# EasyEDA schematic Schematic_Tektronix Auxiliary Front Panel (AFP)_ Rev B.json

## Sheets
1 5V Power Input: TITLE: Tektronix Auxiliary Front Panel (AFP); REV: B; Date: 2026-03-07; Sheet: 1/9; Drawn By: Nawaf Altalhi; Company: Portland State University
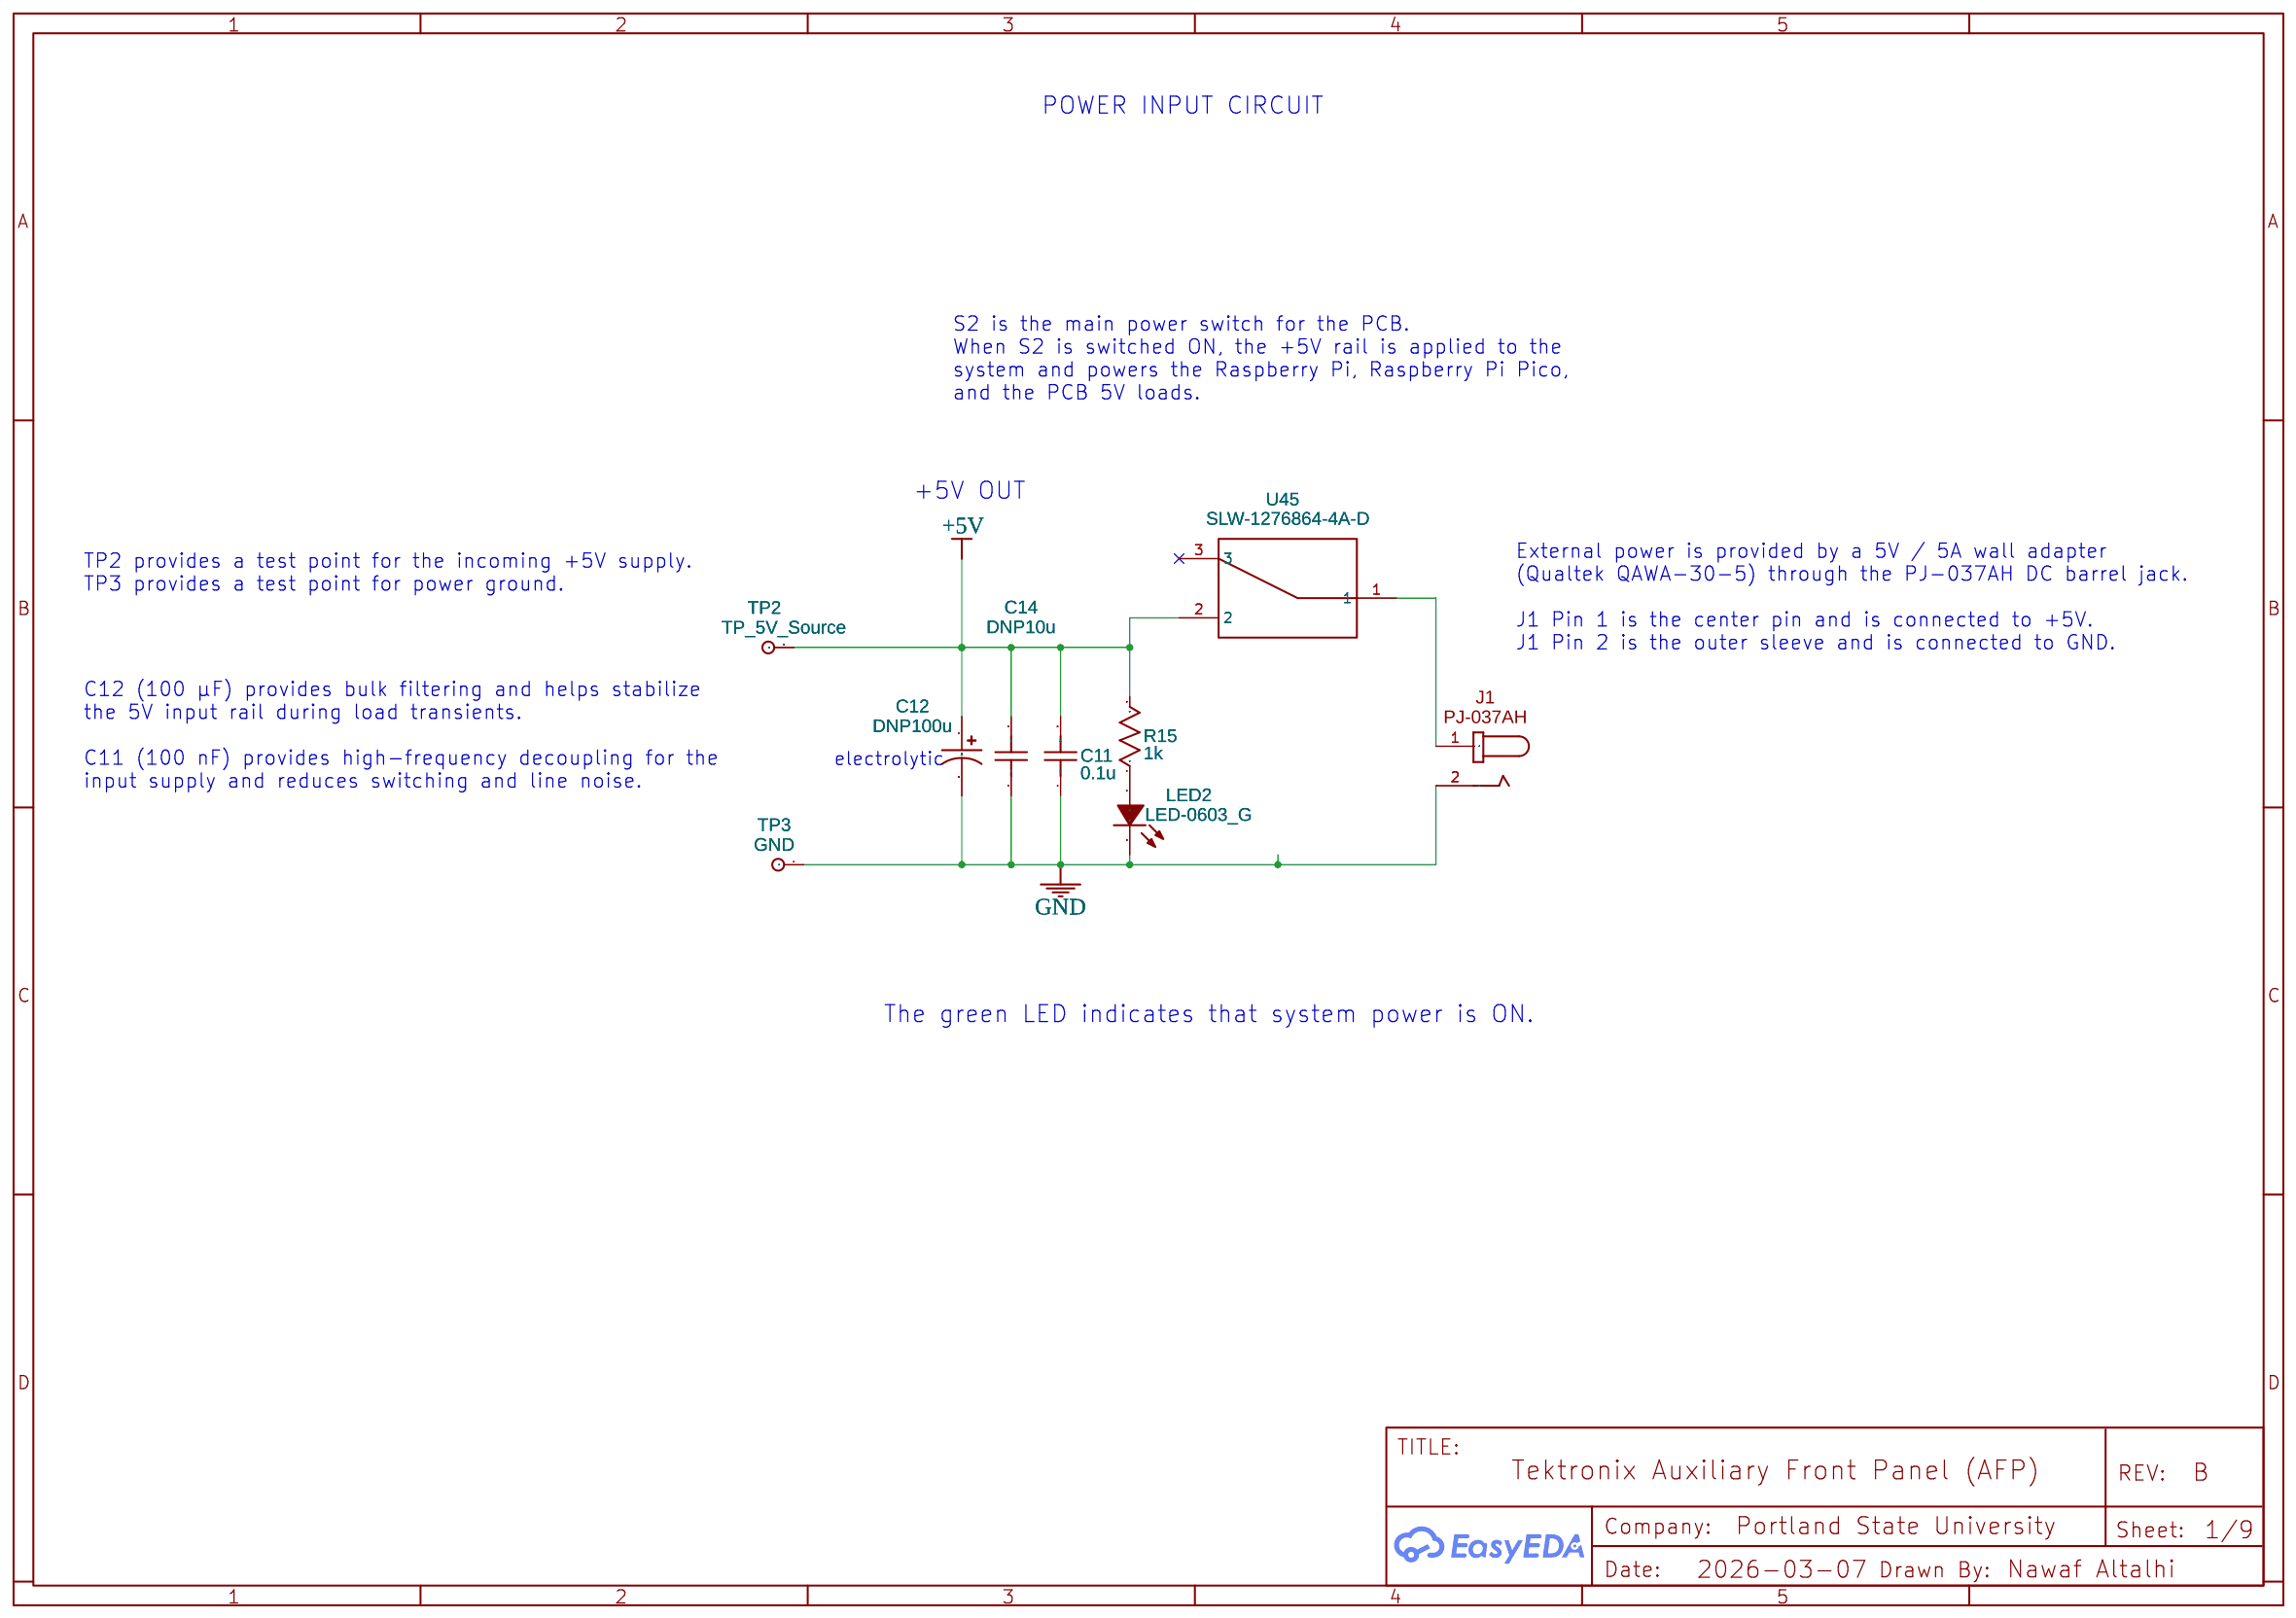
[diagram p0: 5V Power Input]
2 Raspberry Pi Pico Interface: Sheet: 2/9
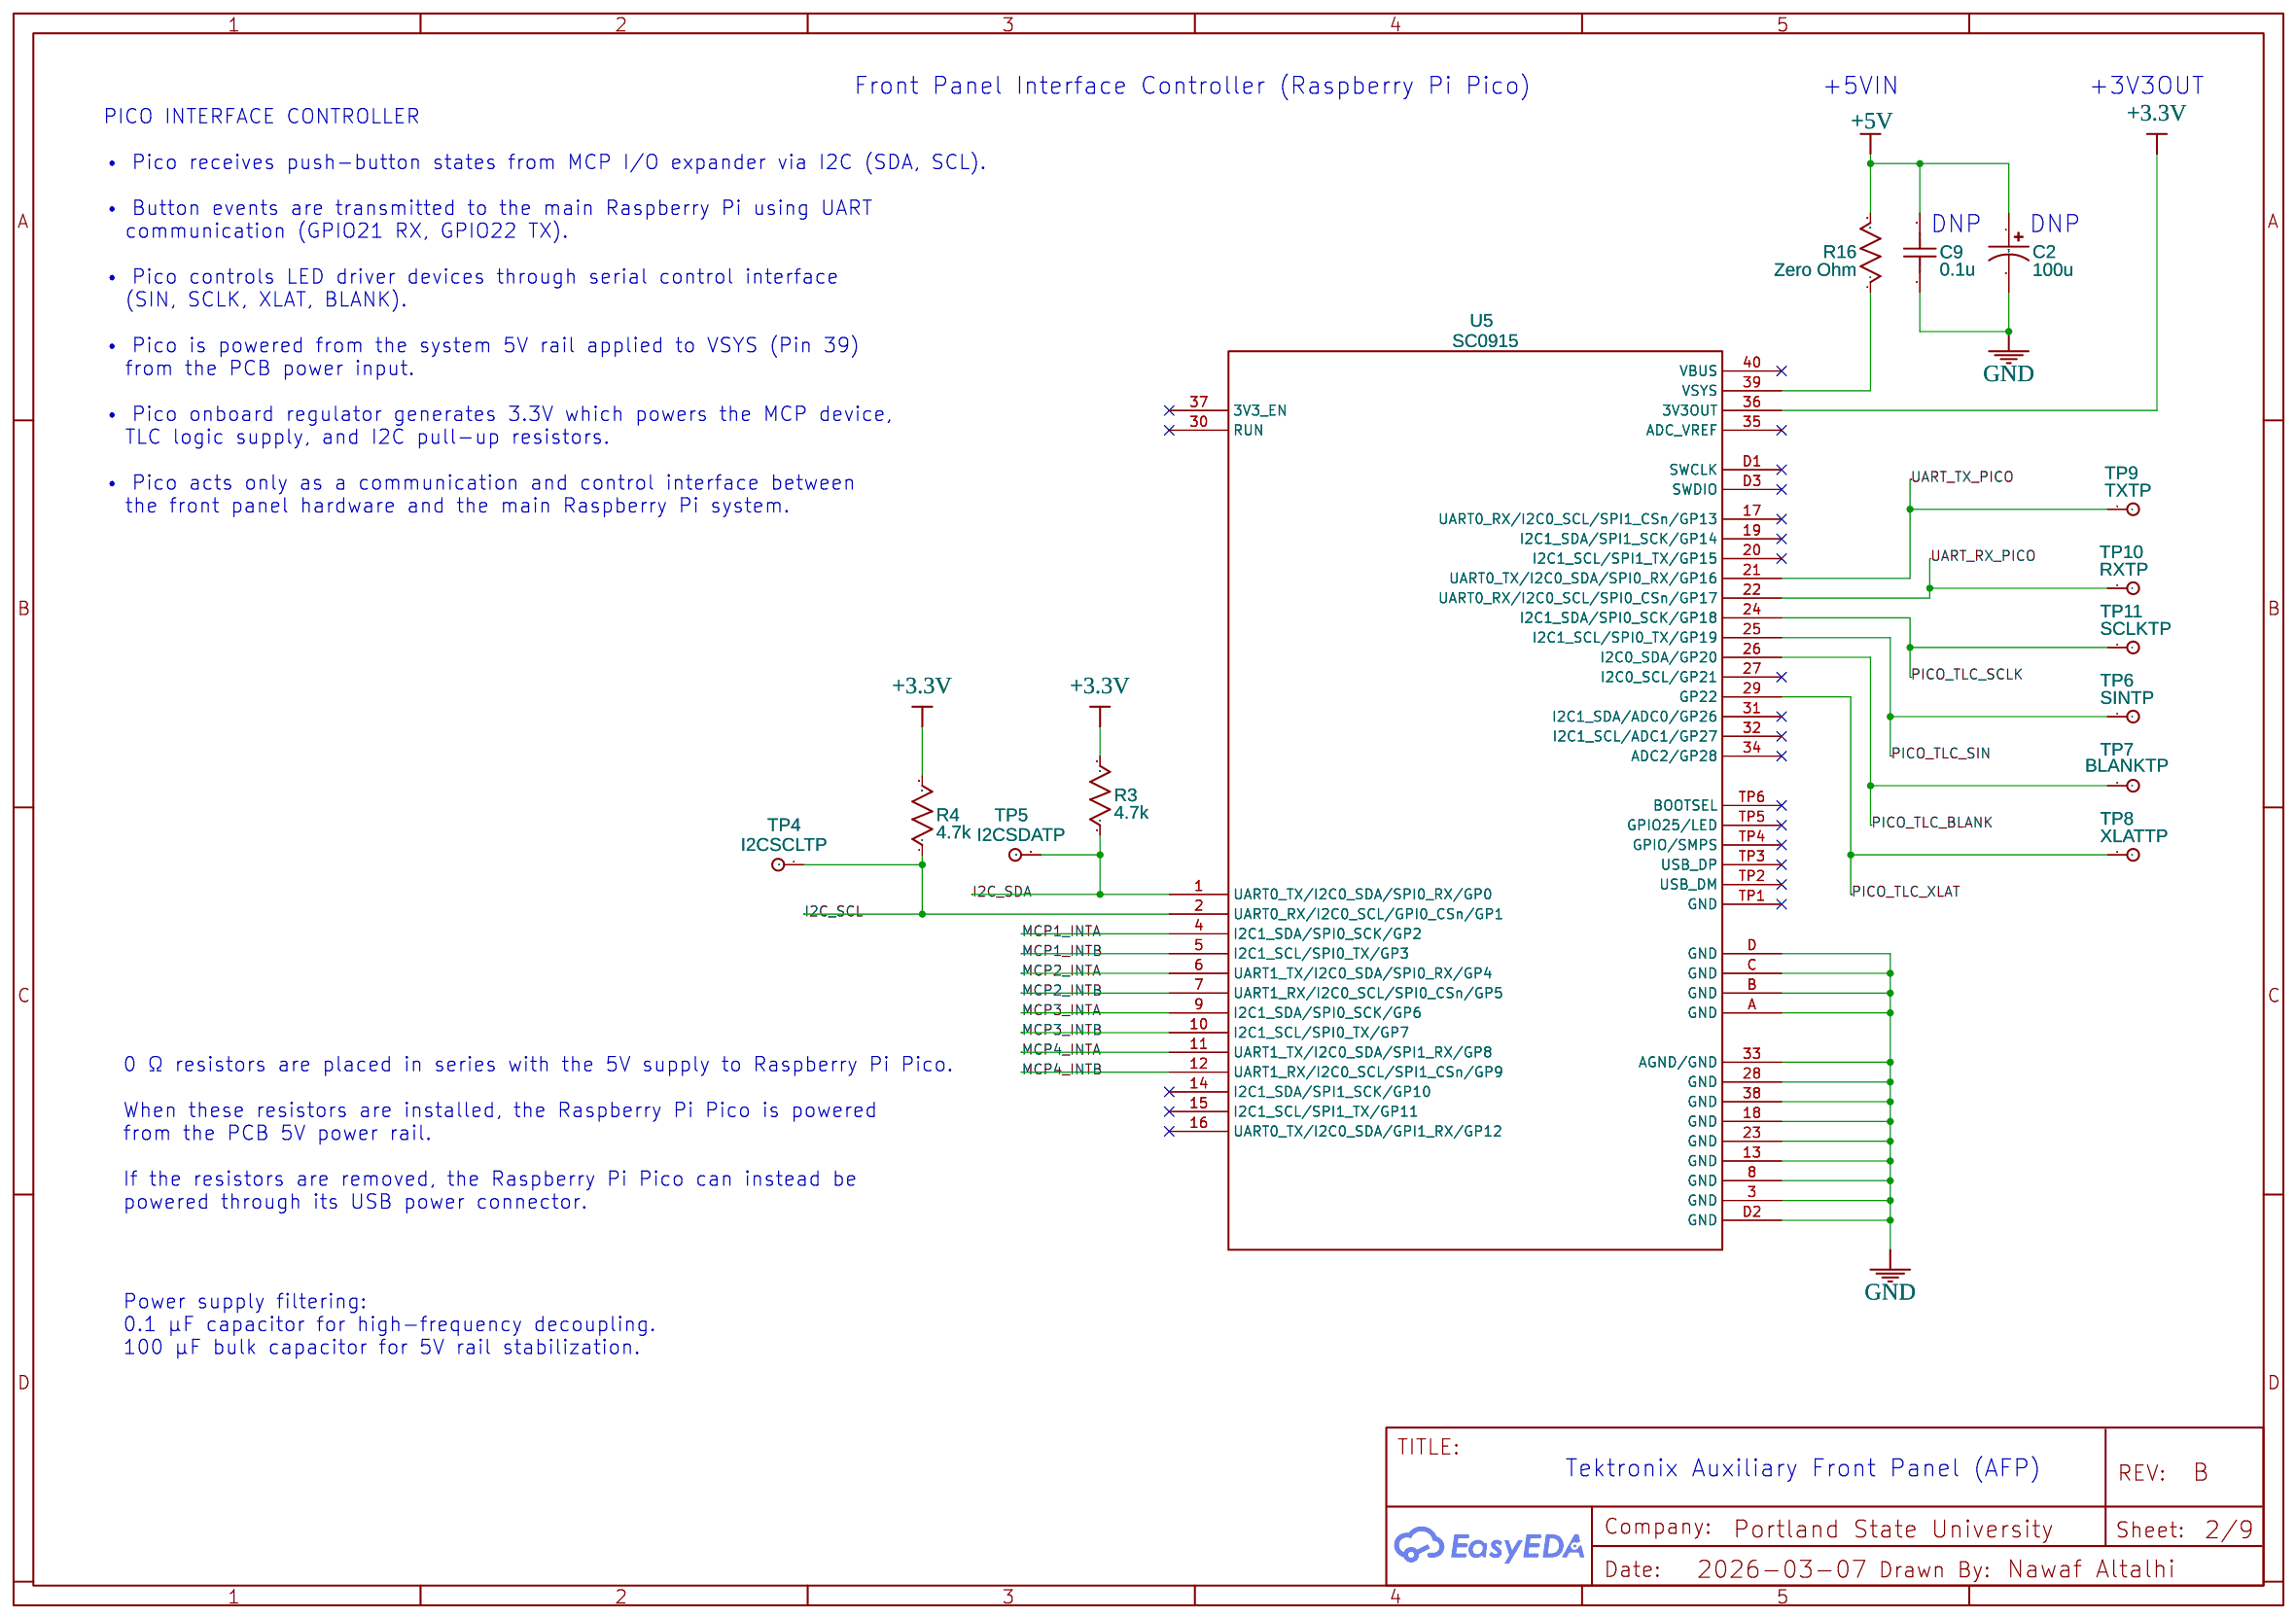
[diagram p1: Raspberry Pi Pico Interface]
3 Raspberry Pi Controller: Date: 2026-03-08; Sheet: 3/9
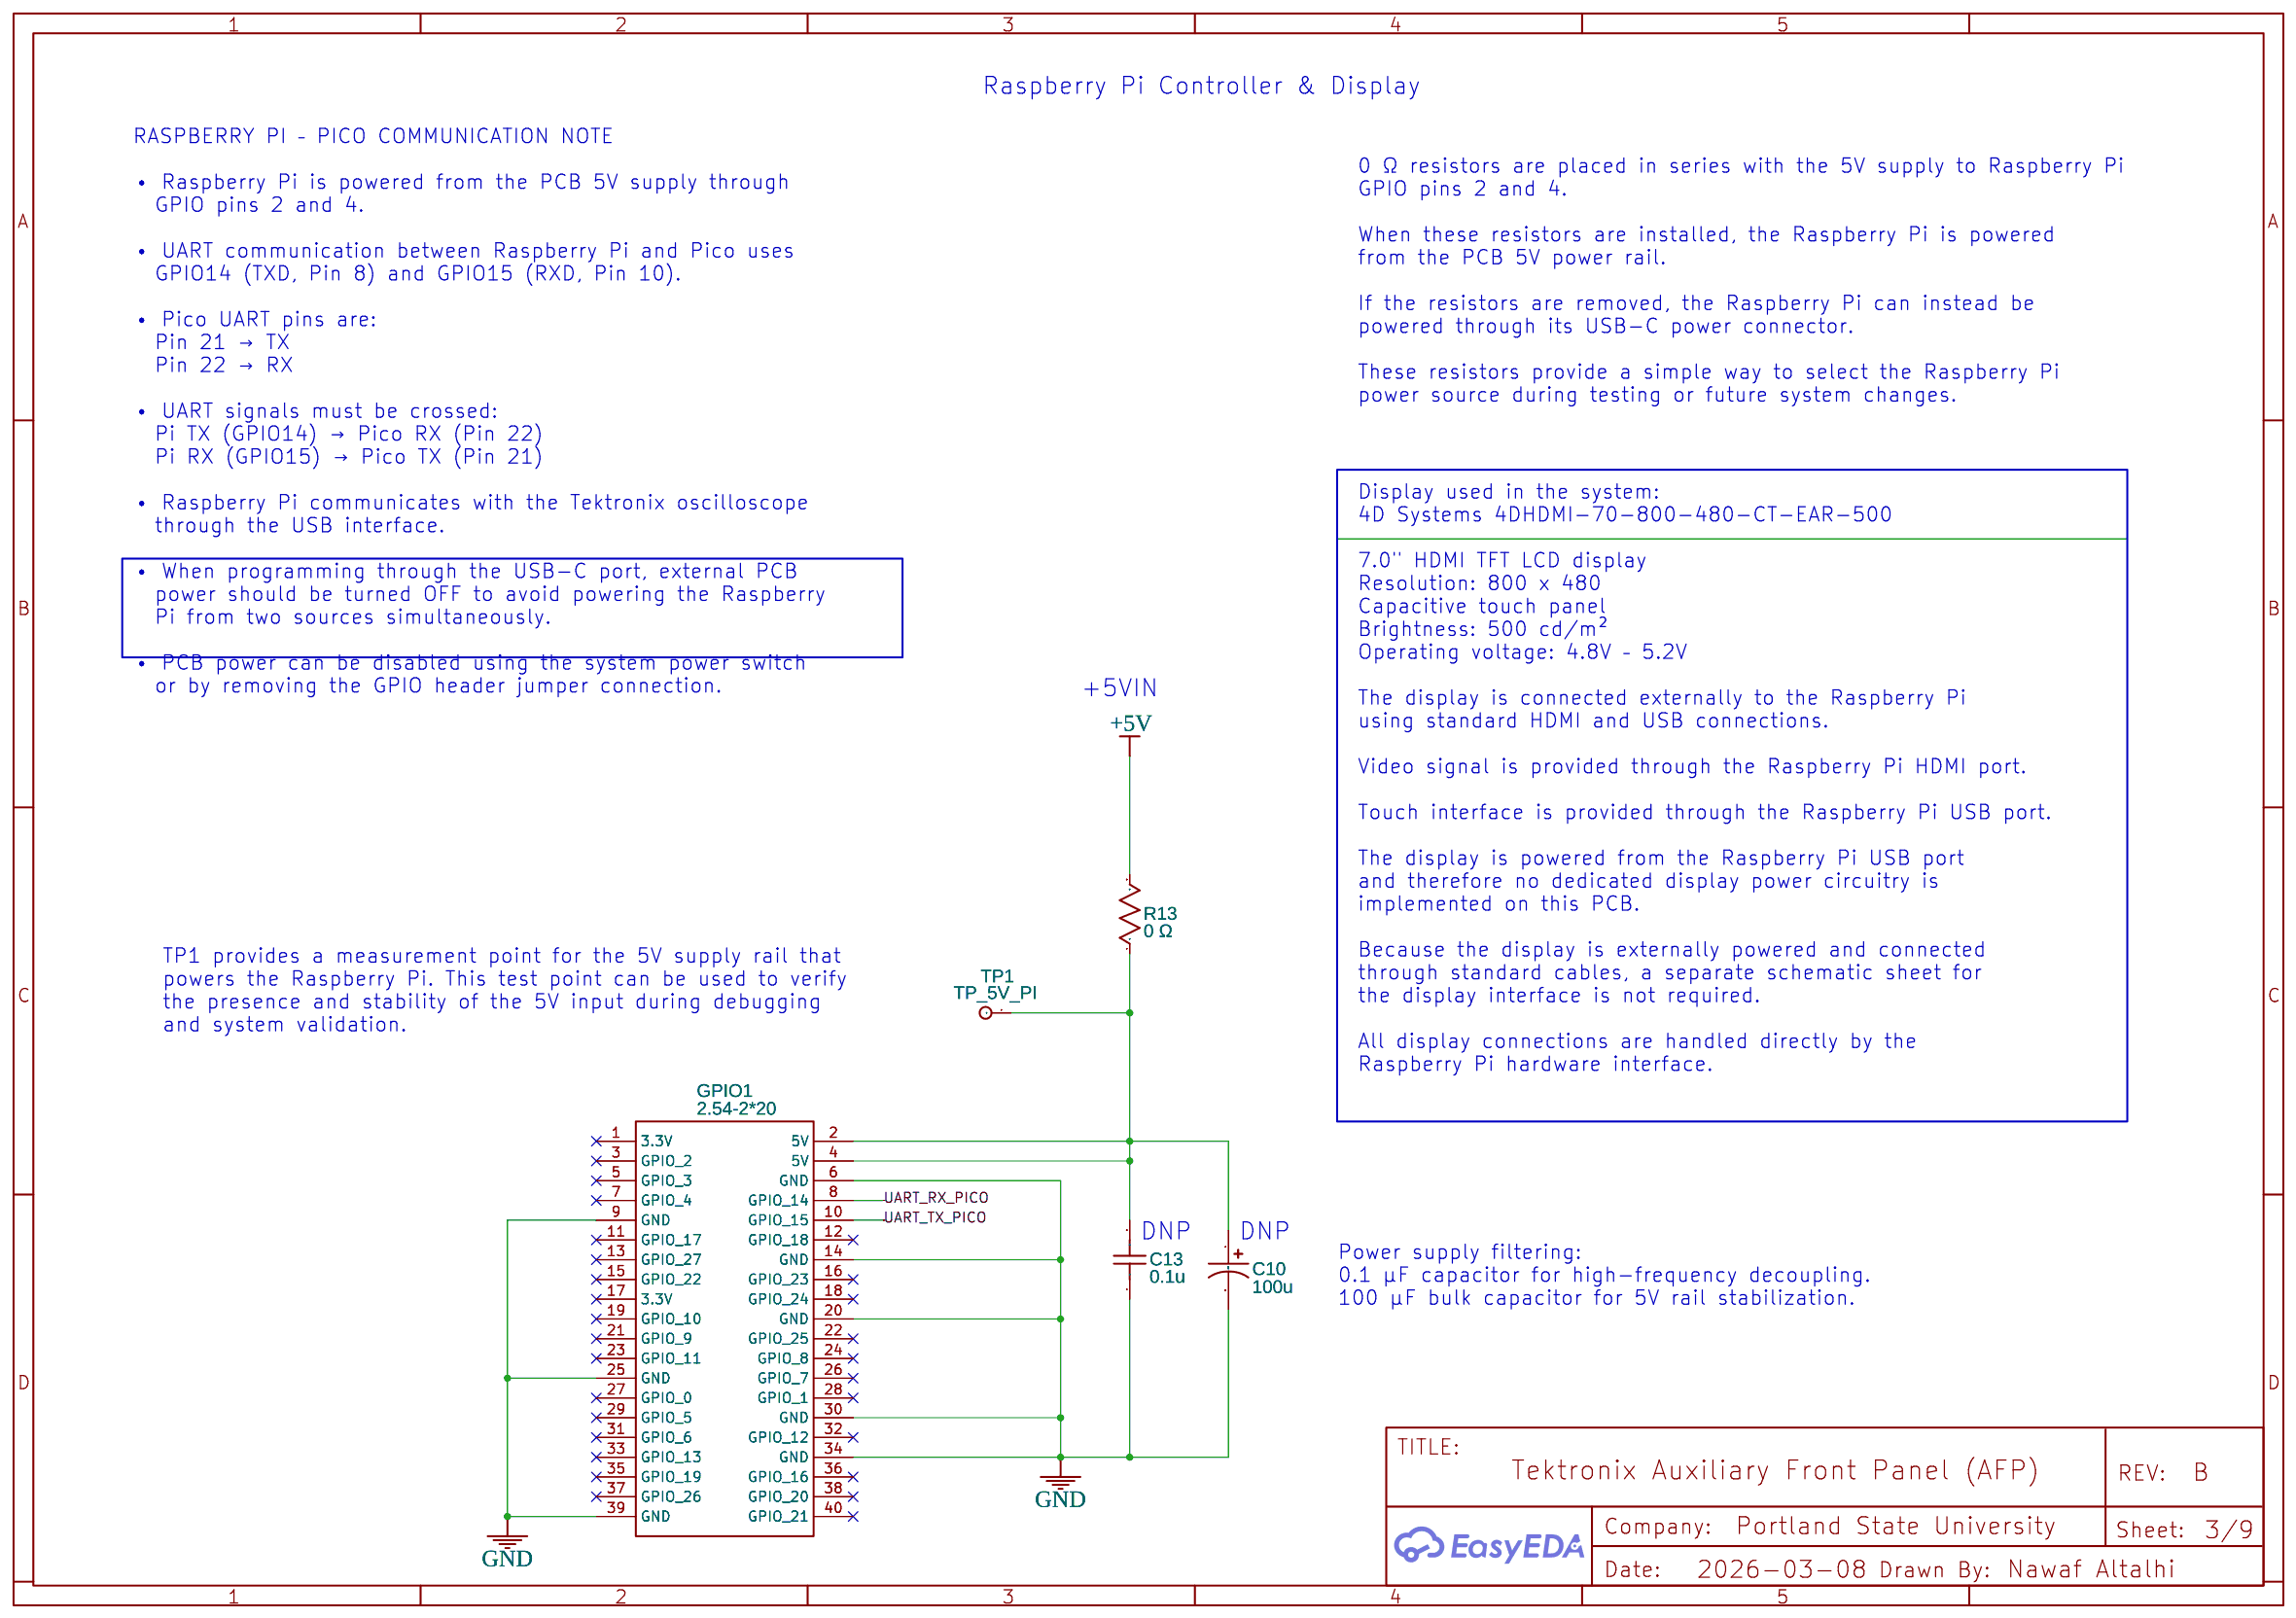
[diagram p2: Raspberry Pi Controller]
4 MCP23017: Date: 2026-03-09; Sheet: 4/9
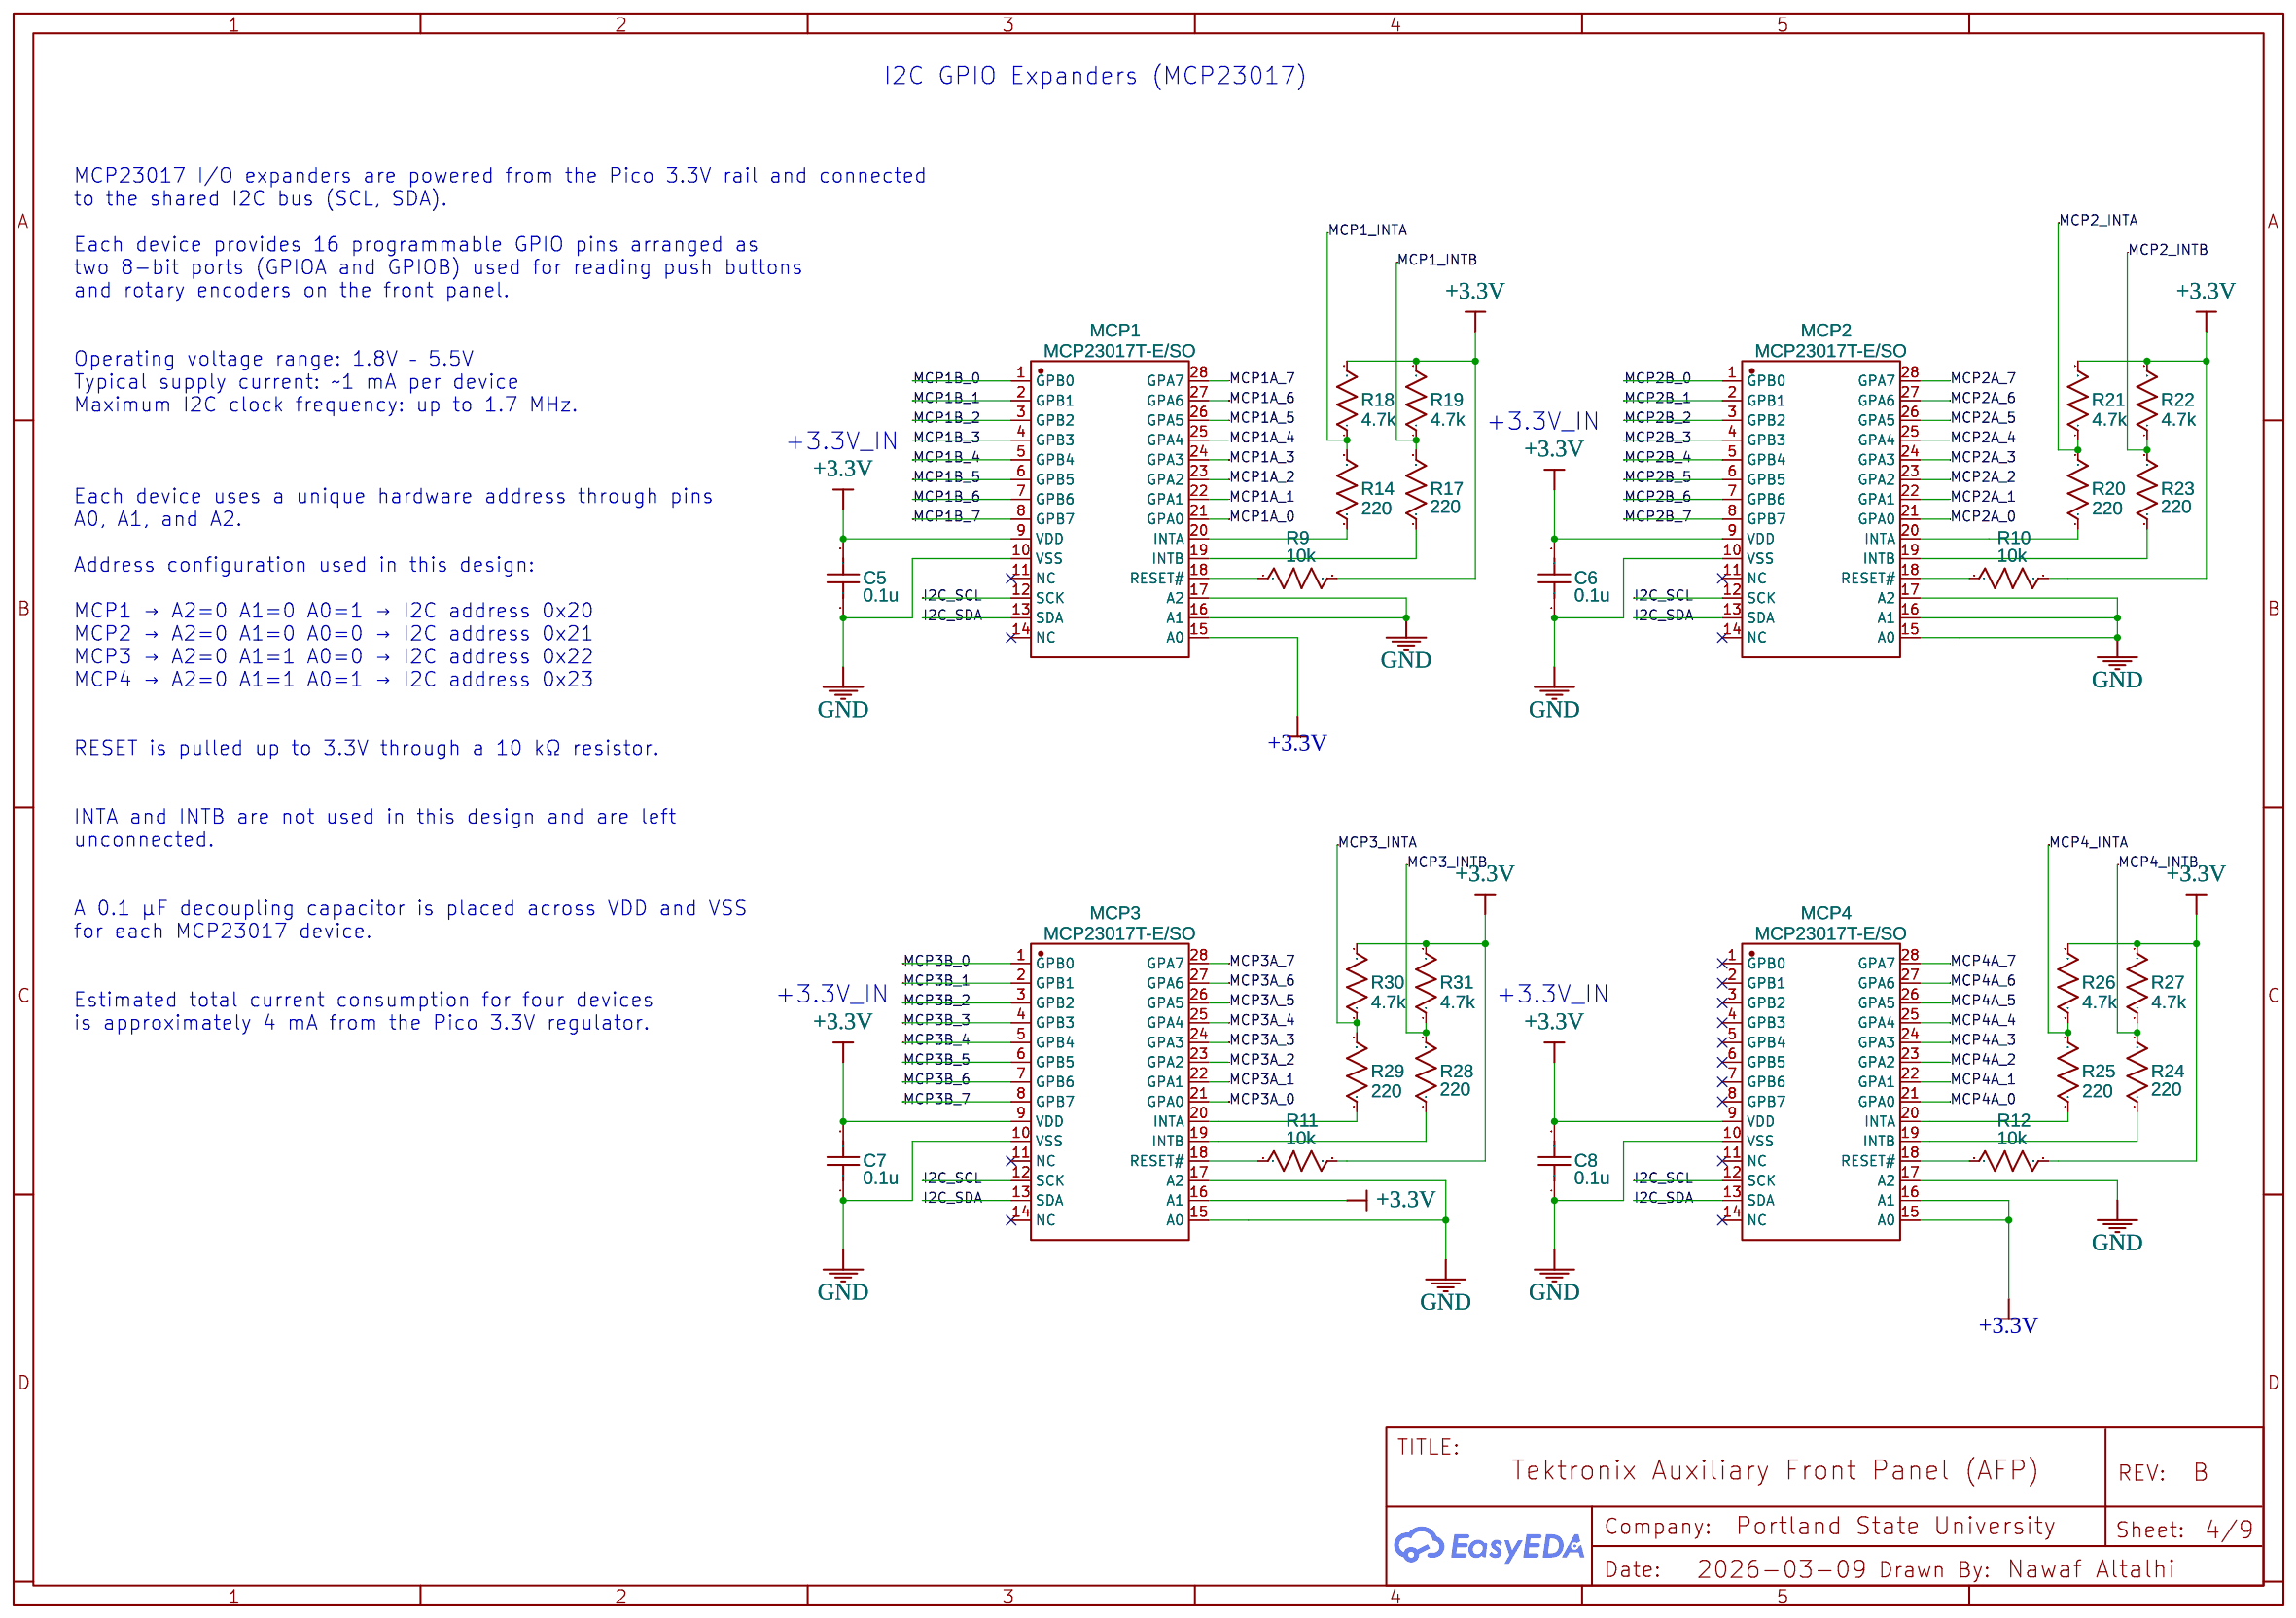
[diagram p3: MCP23017]
5 TLC5947: Date: 2026-03-08; Sheet: 5/9
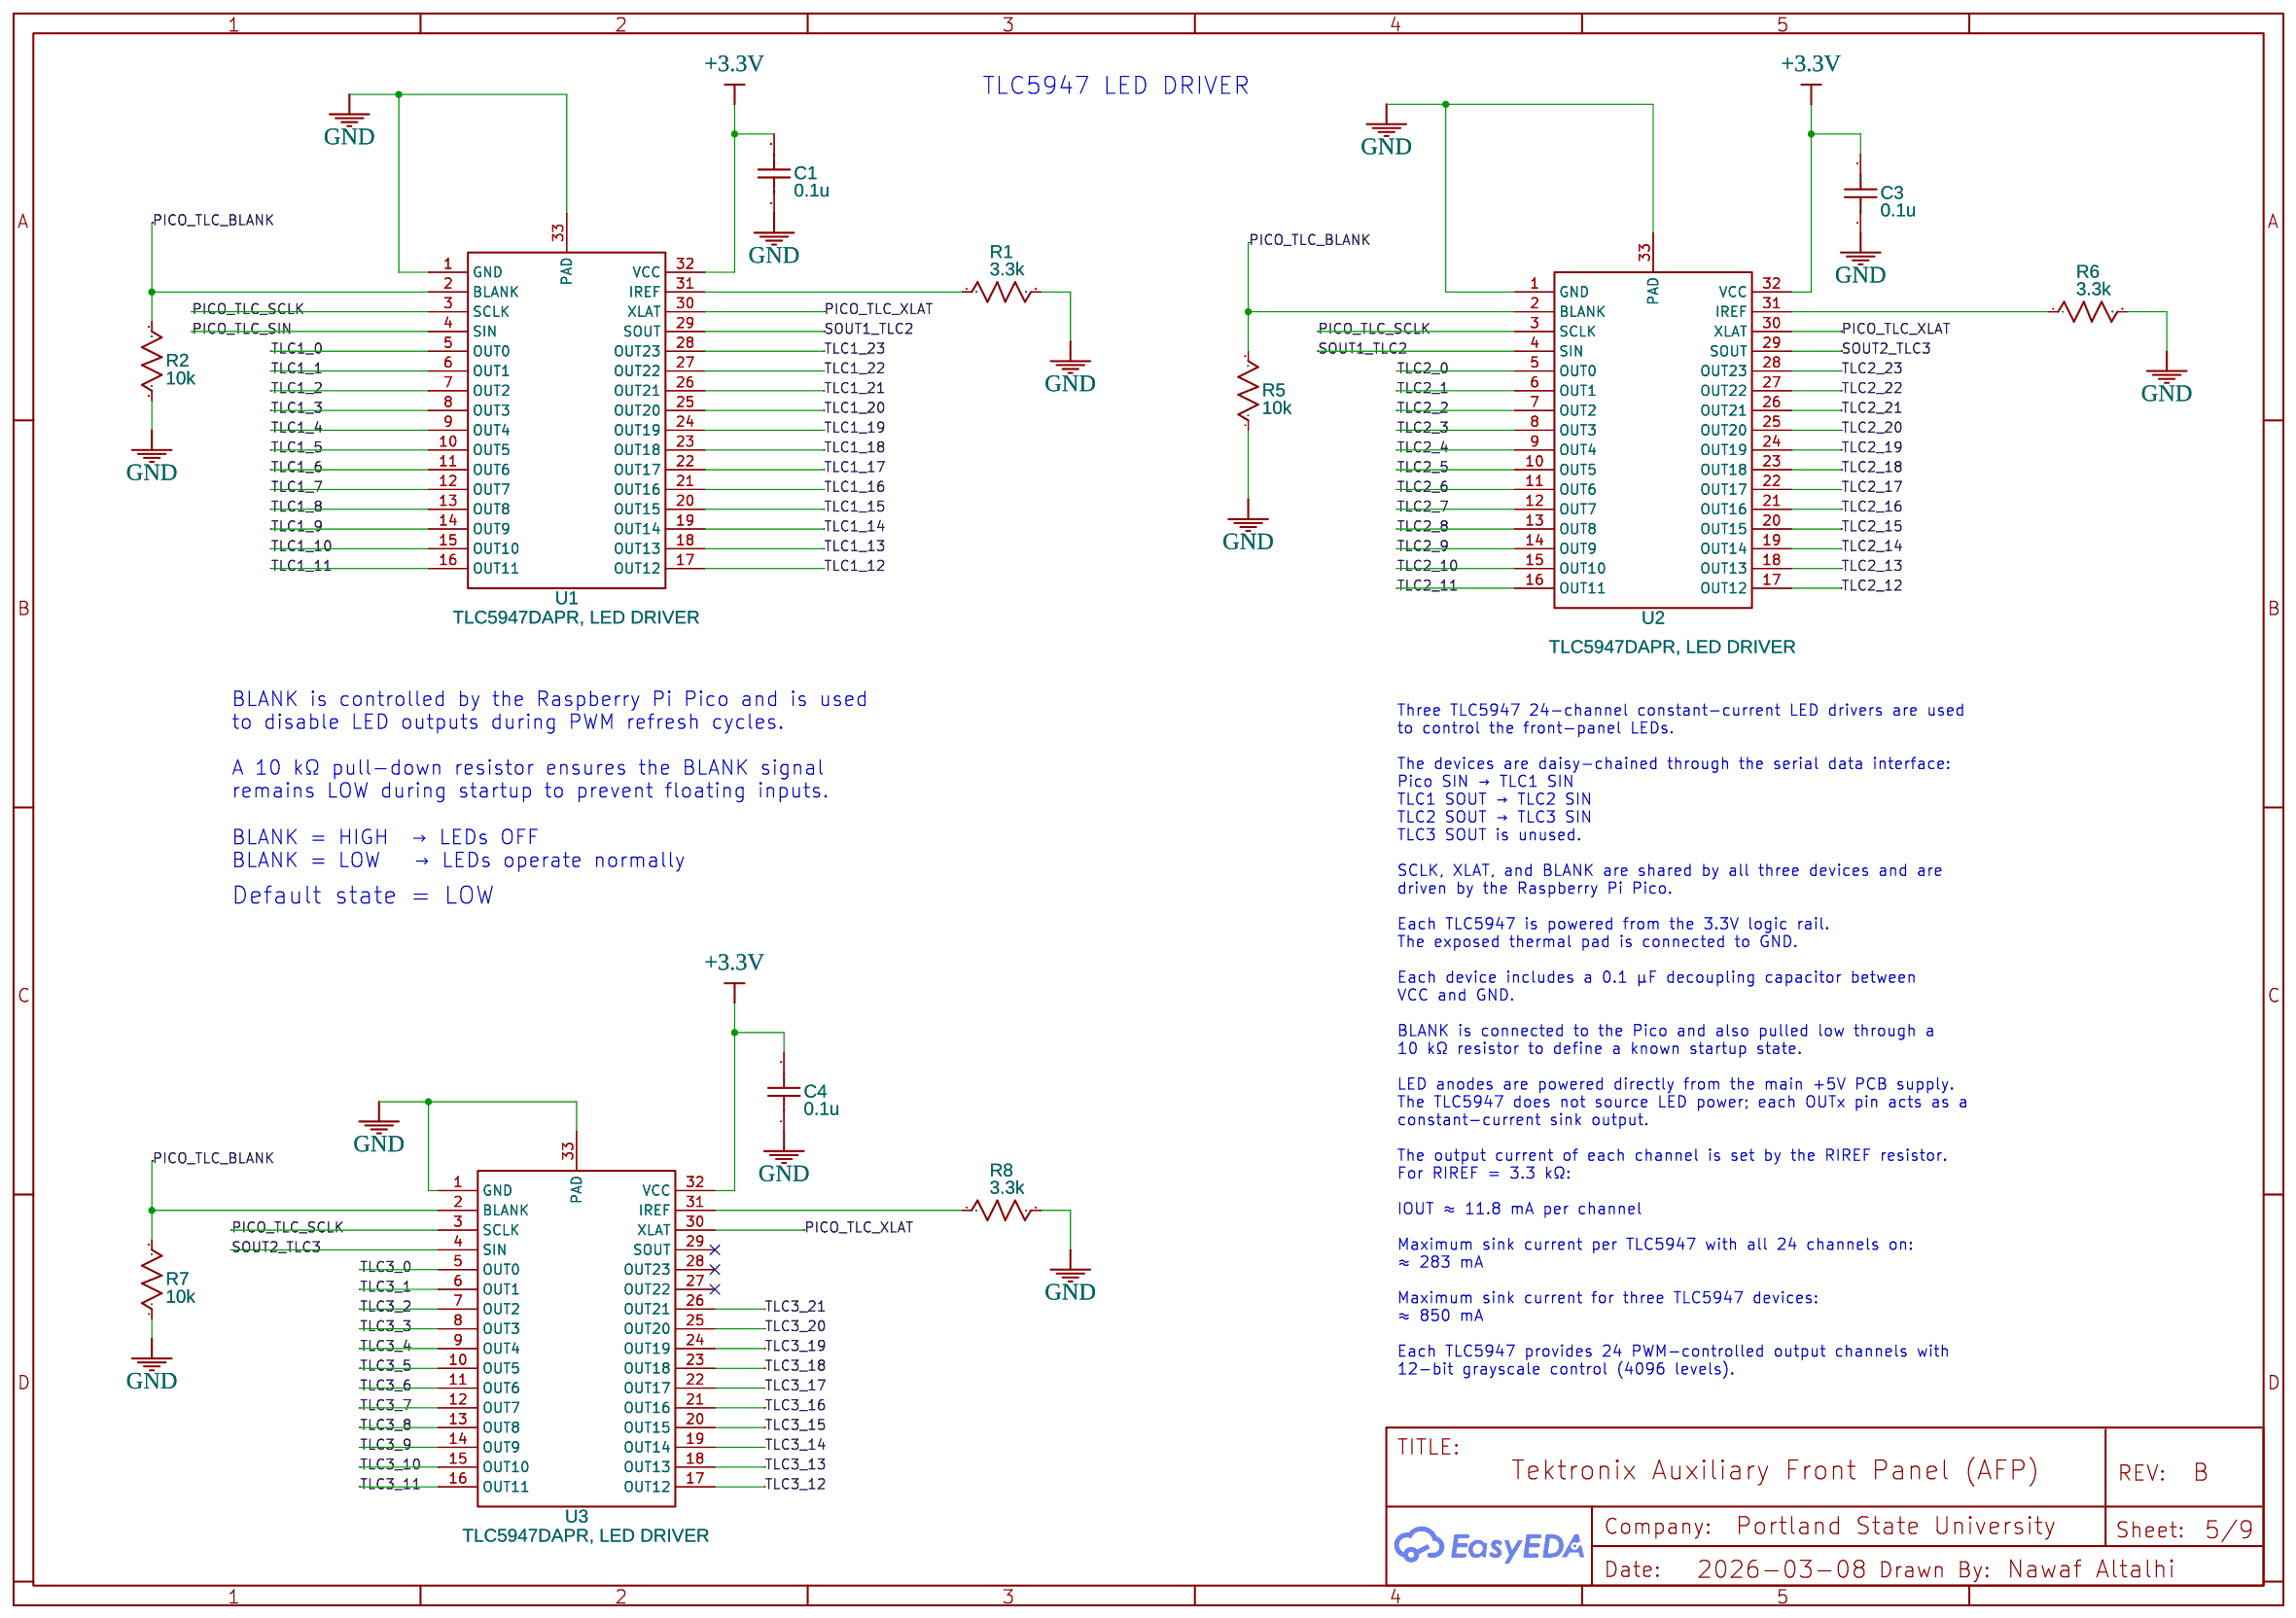
[diagram p4: TLC5947]
6 Acquisition & Trigger Controls: Date: 2026-03-09; Sheet: 6/9
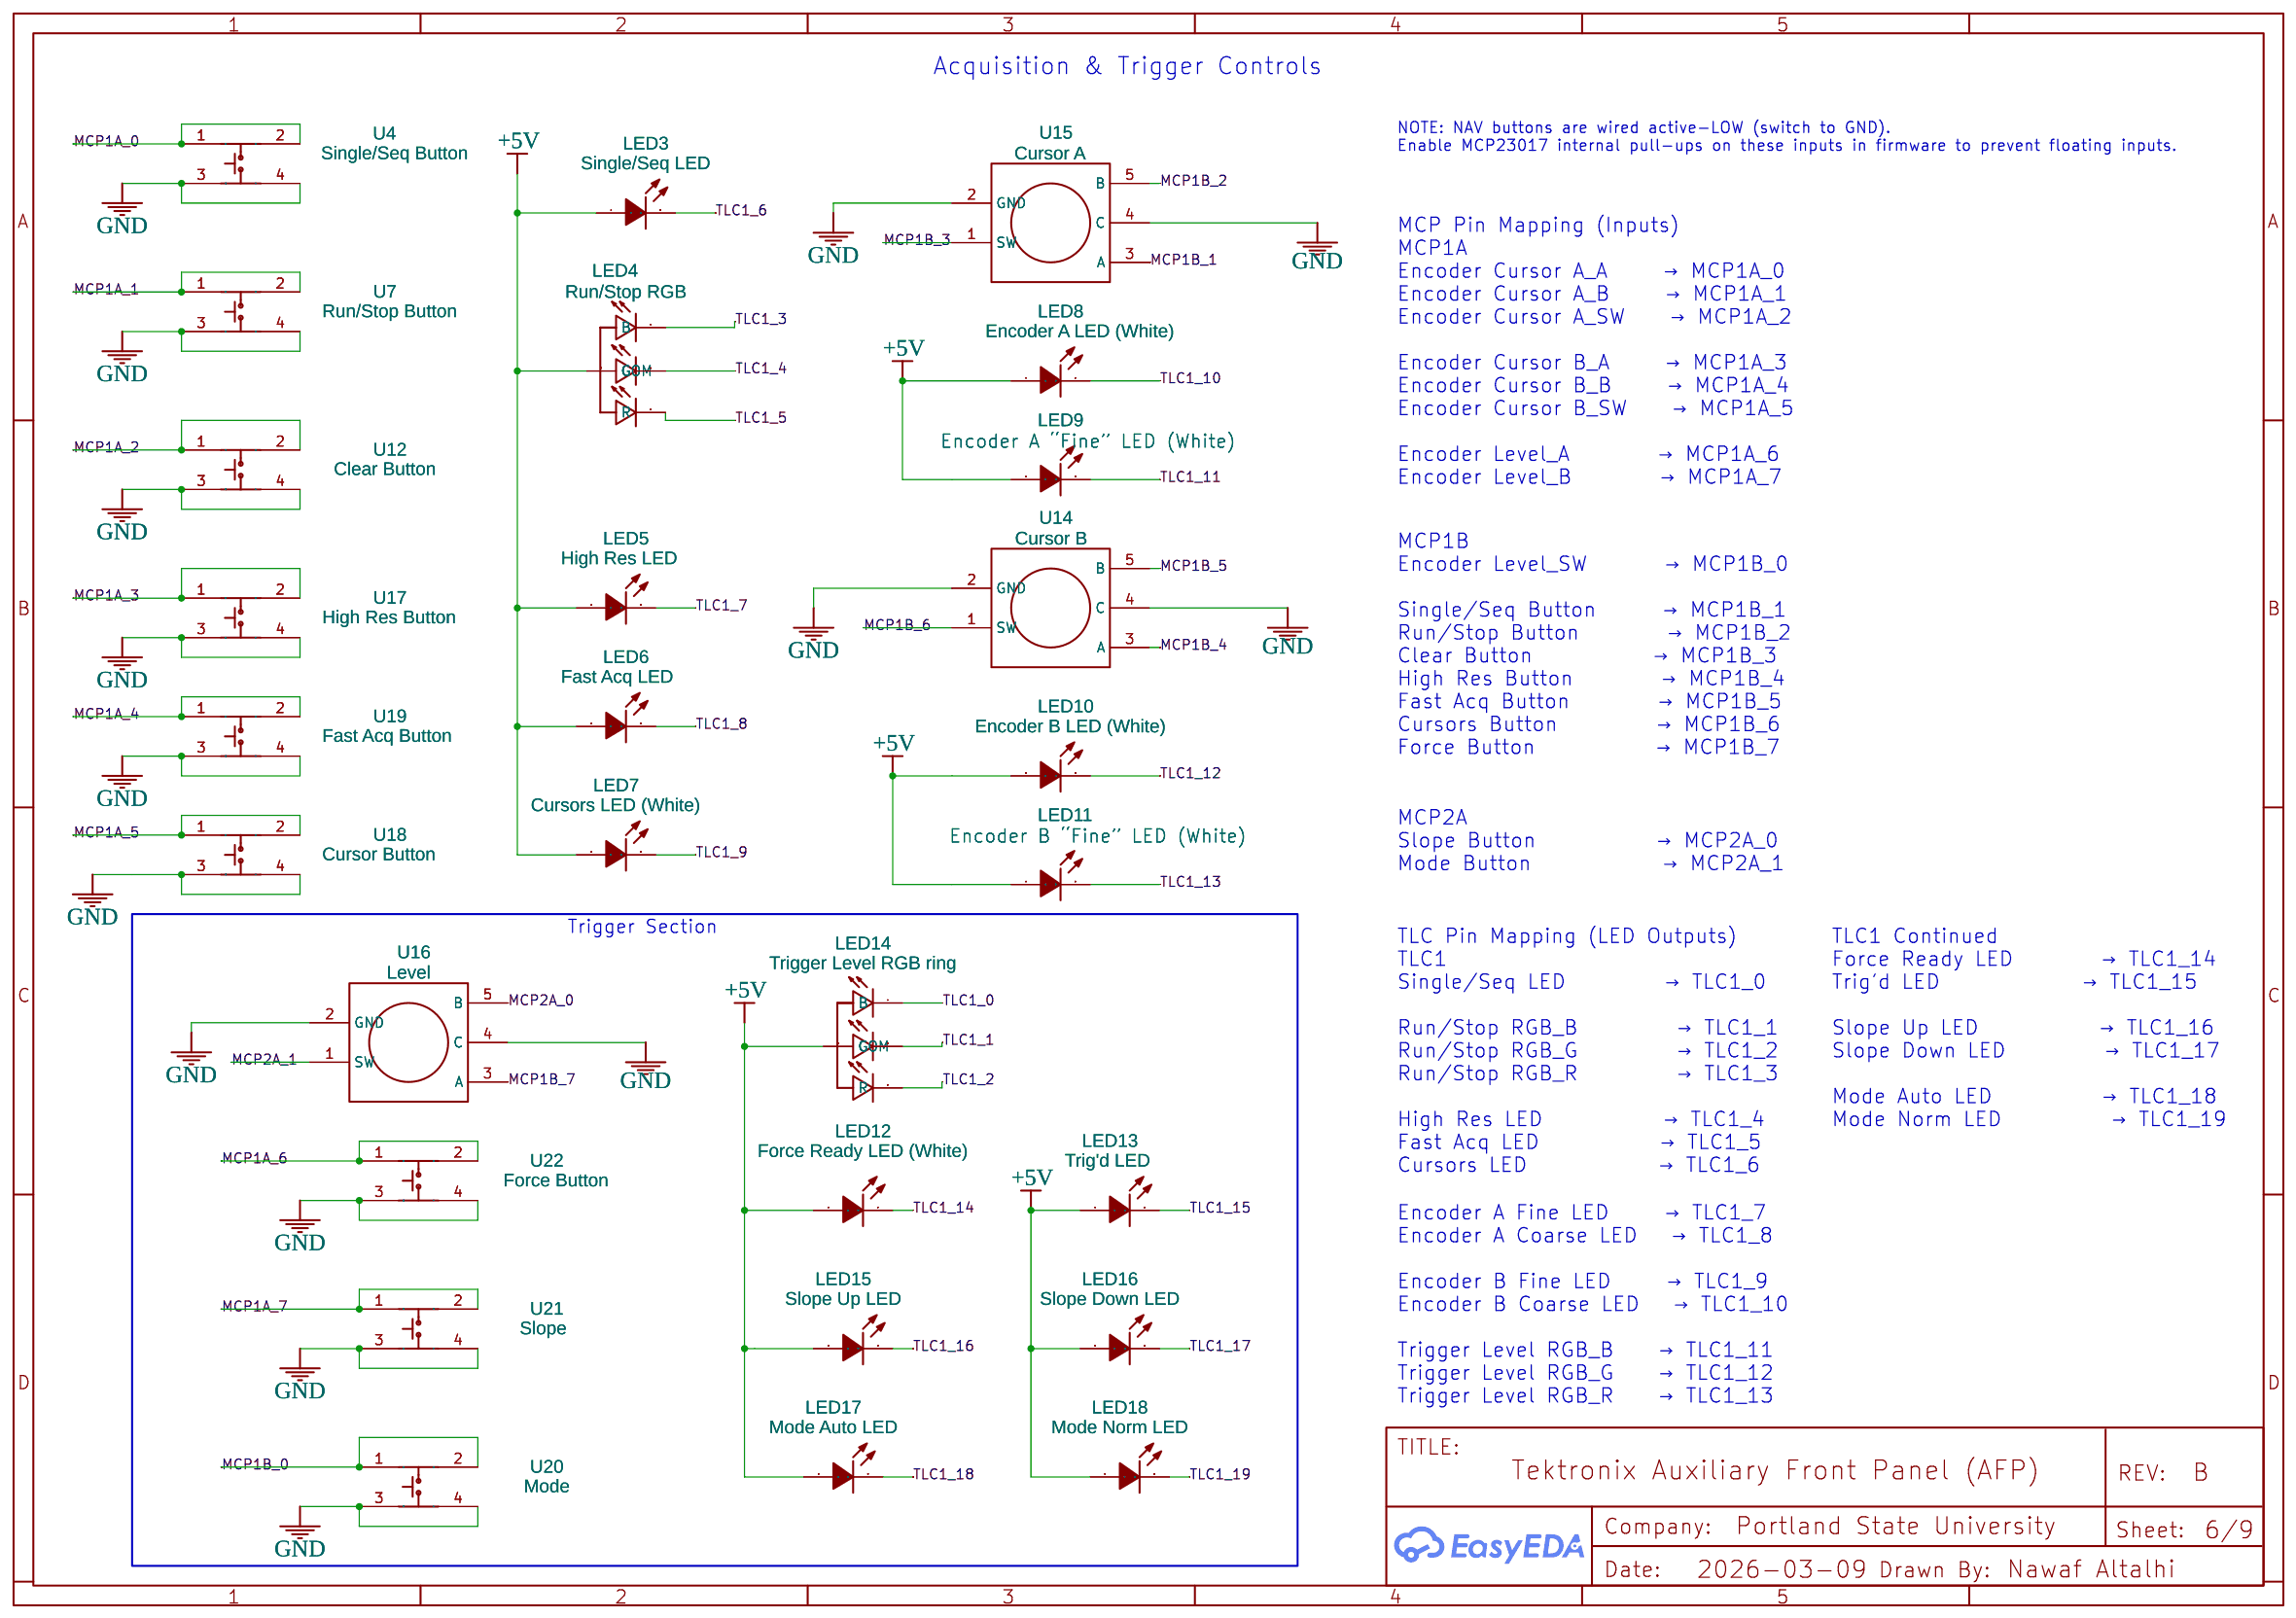
[diagram p5: Acquisition & Trigger Controls]
7 VERTICAL: Date: 2026-03-09; Sheet: 7/9
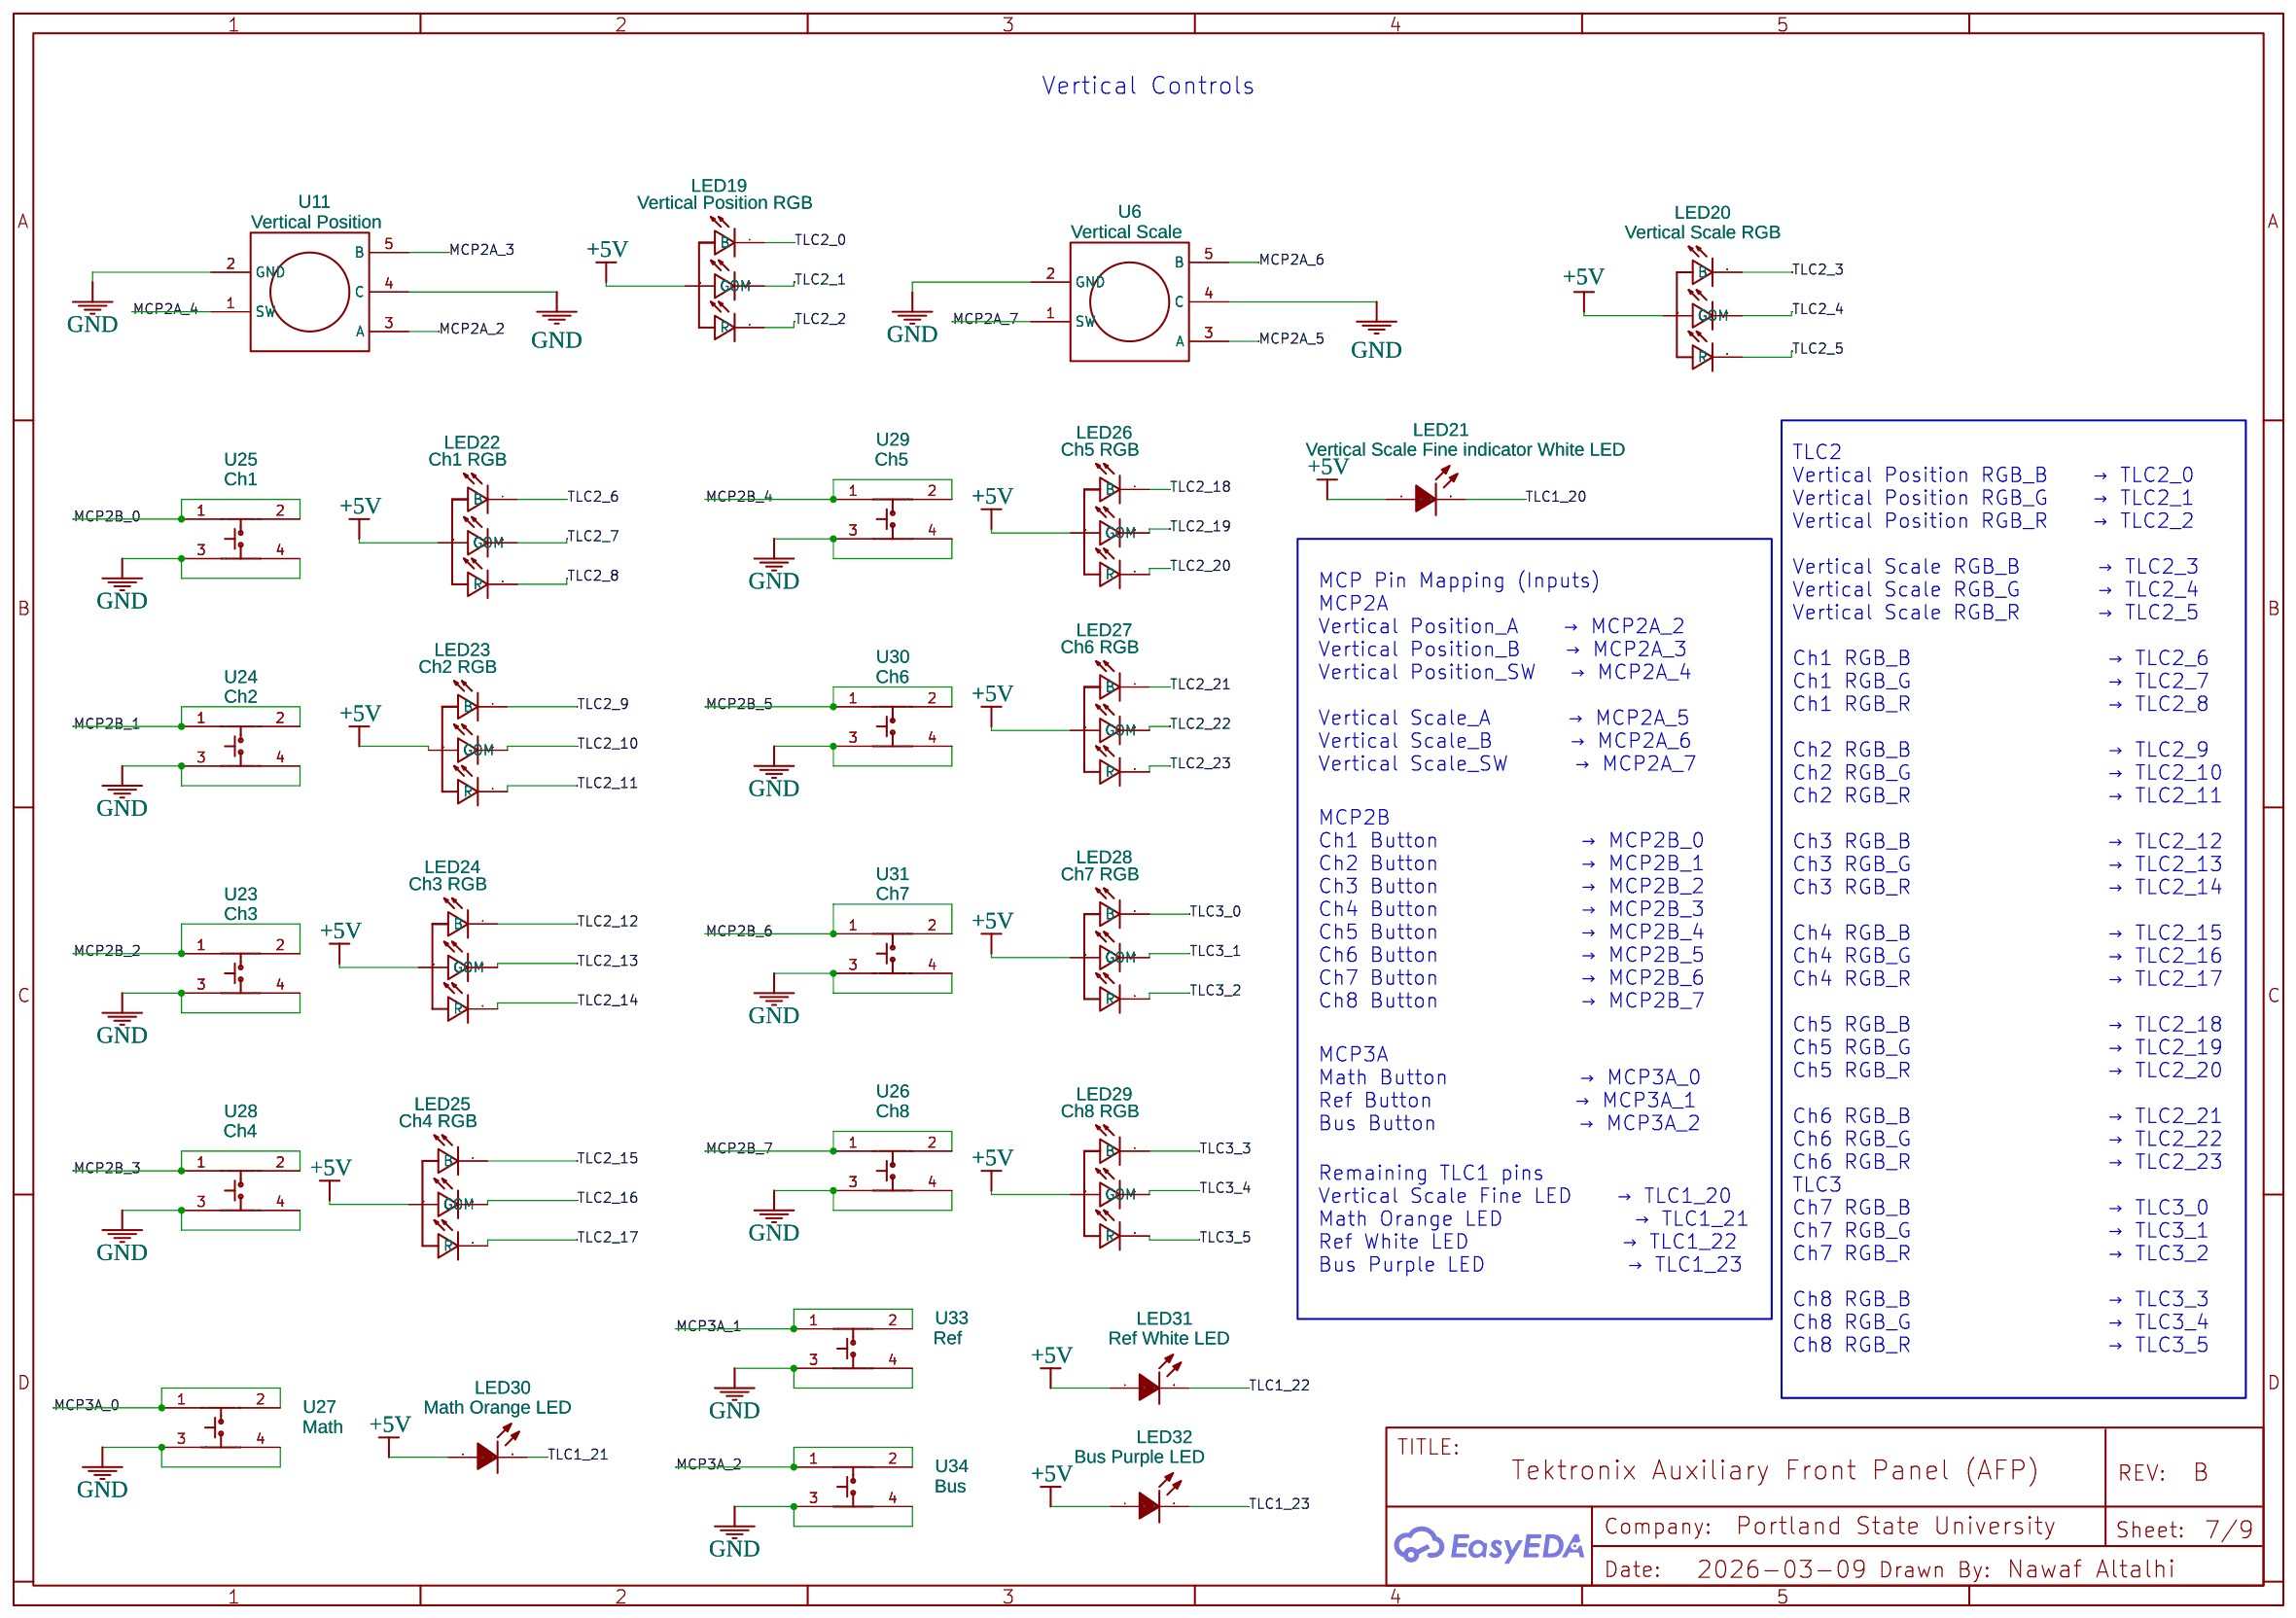
[diagram p6: VERTICAL]
8 HORIZONTAL: Date: 2026-03-09; Sheet: 8/9
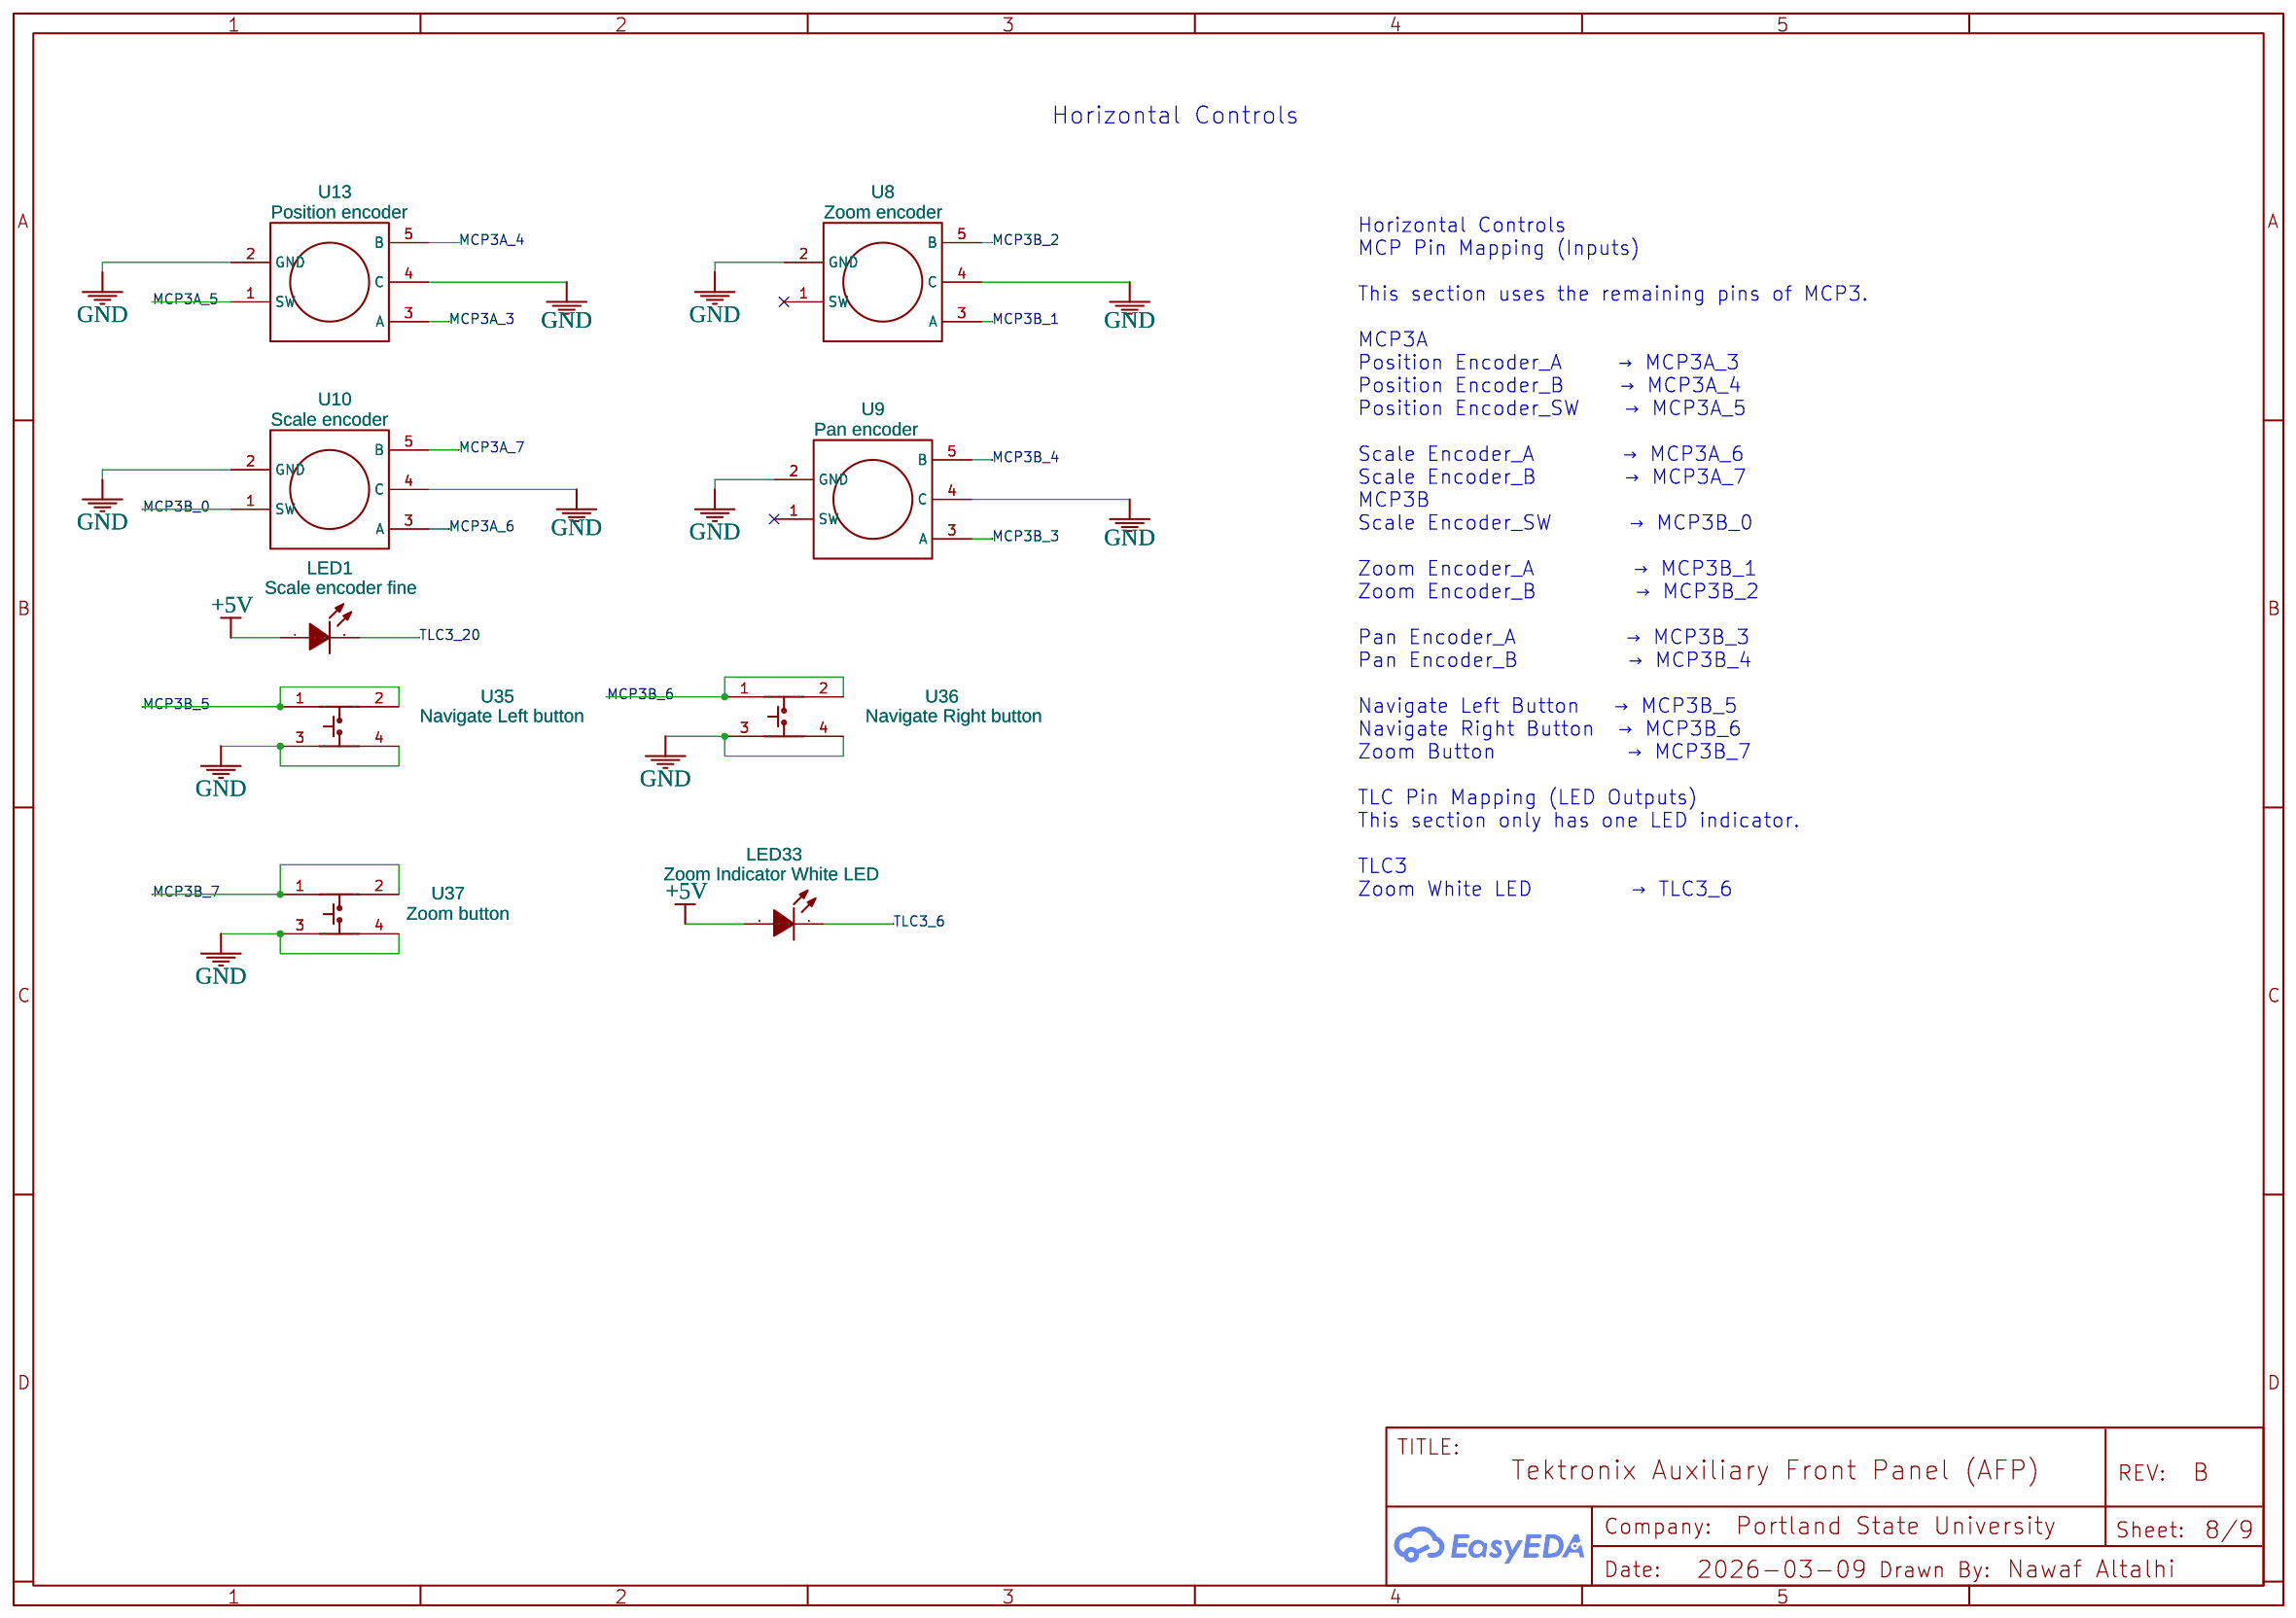
[diagram p7: HORIZONTAL]
9 Miscellaneous controls& Macro: Date: 2026-03-09; Sheet: 9/9
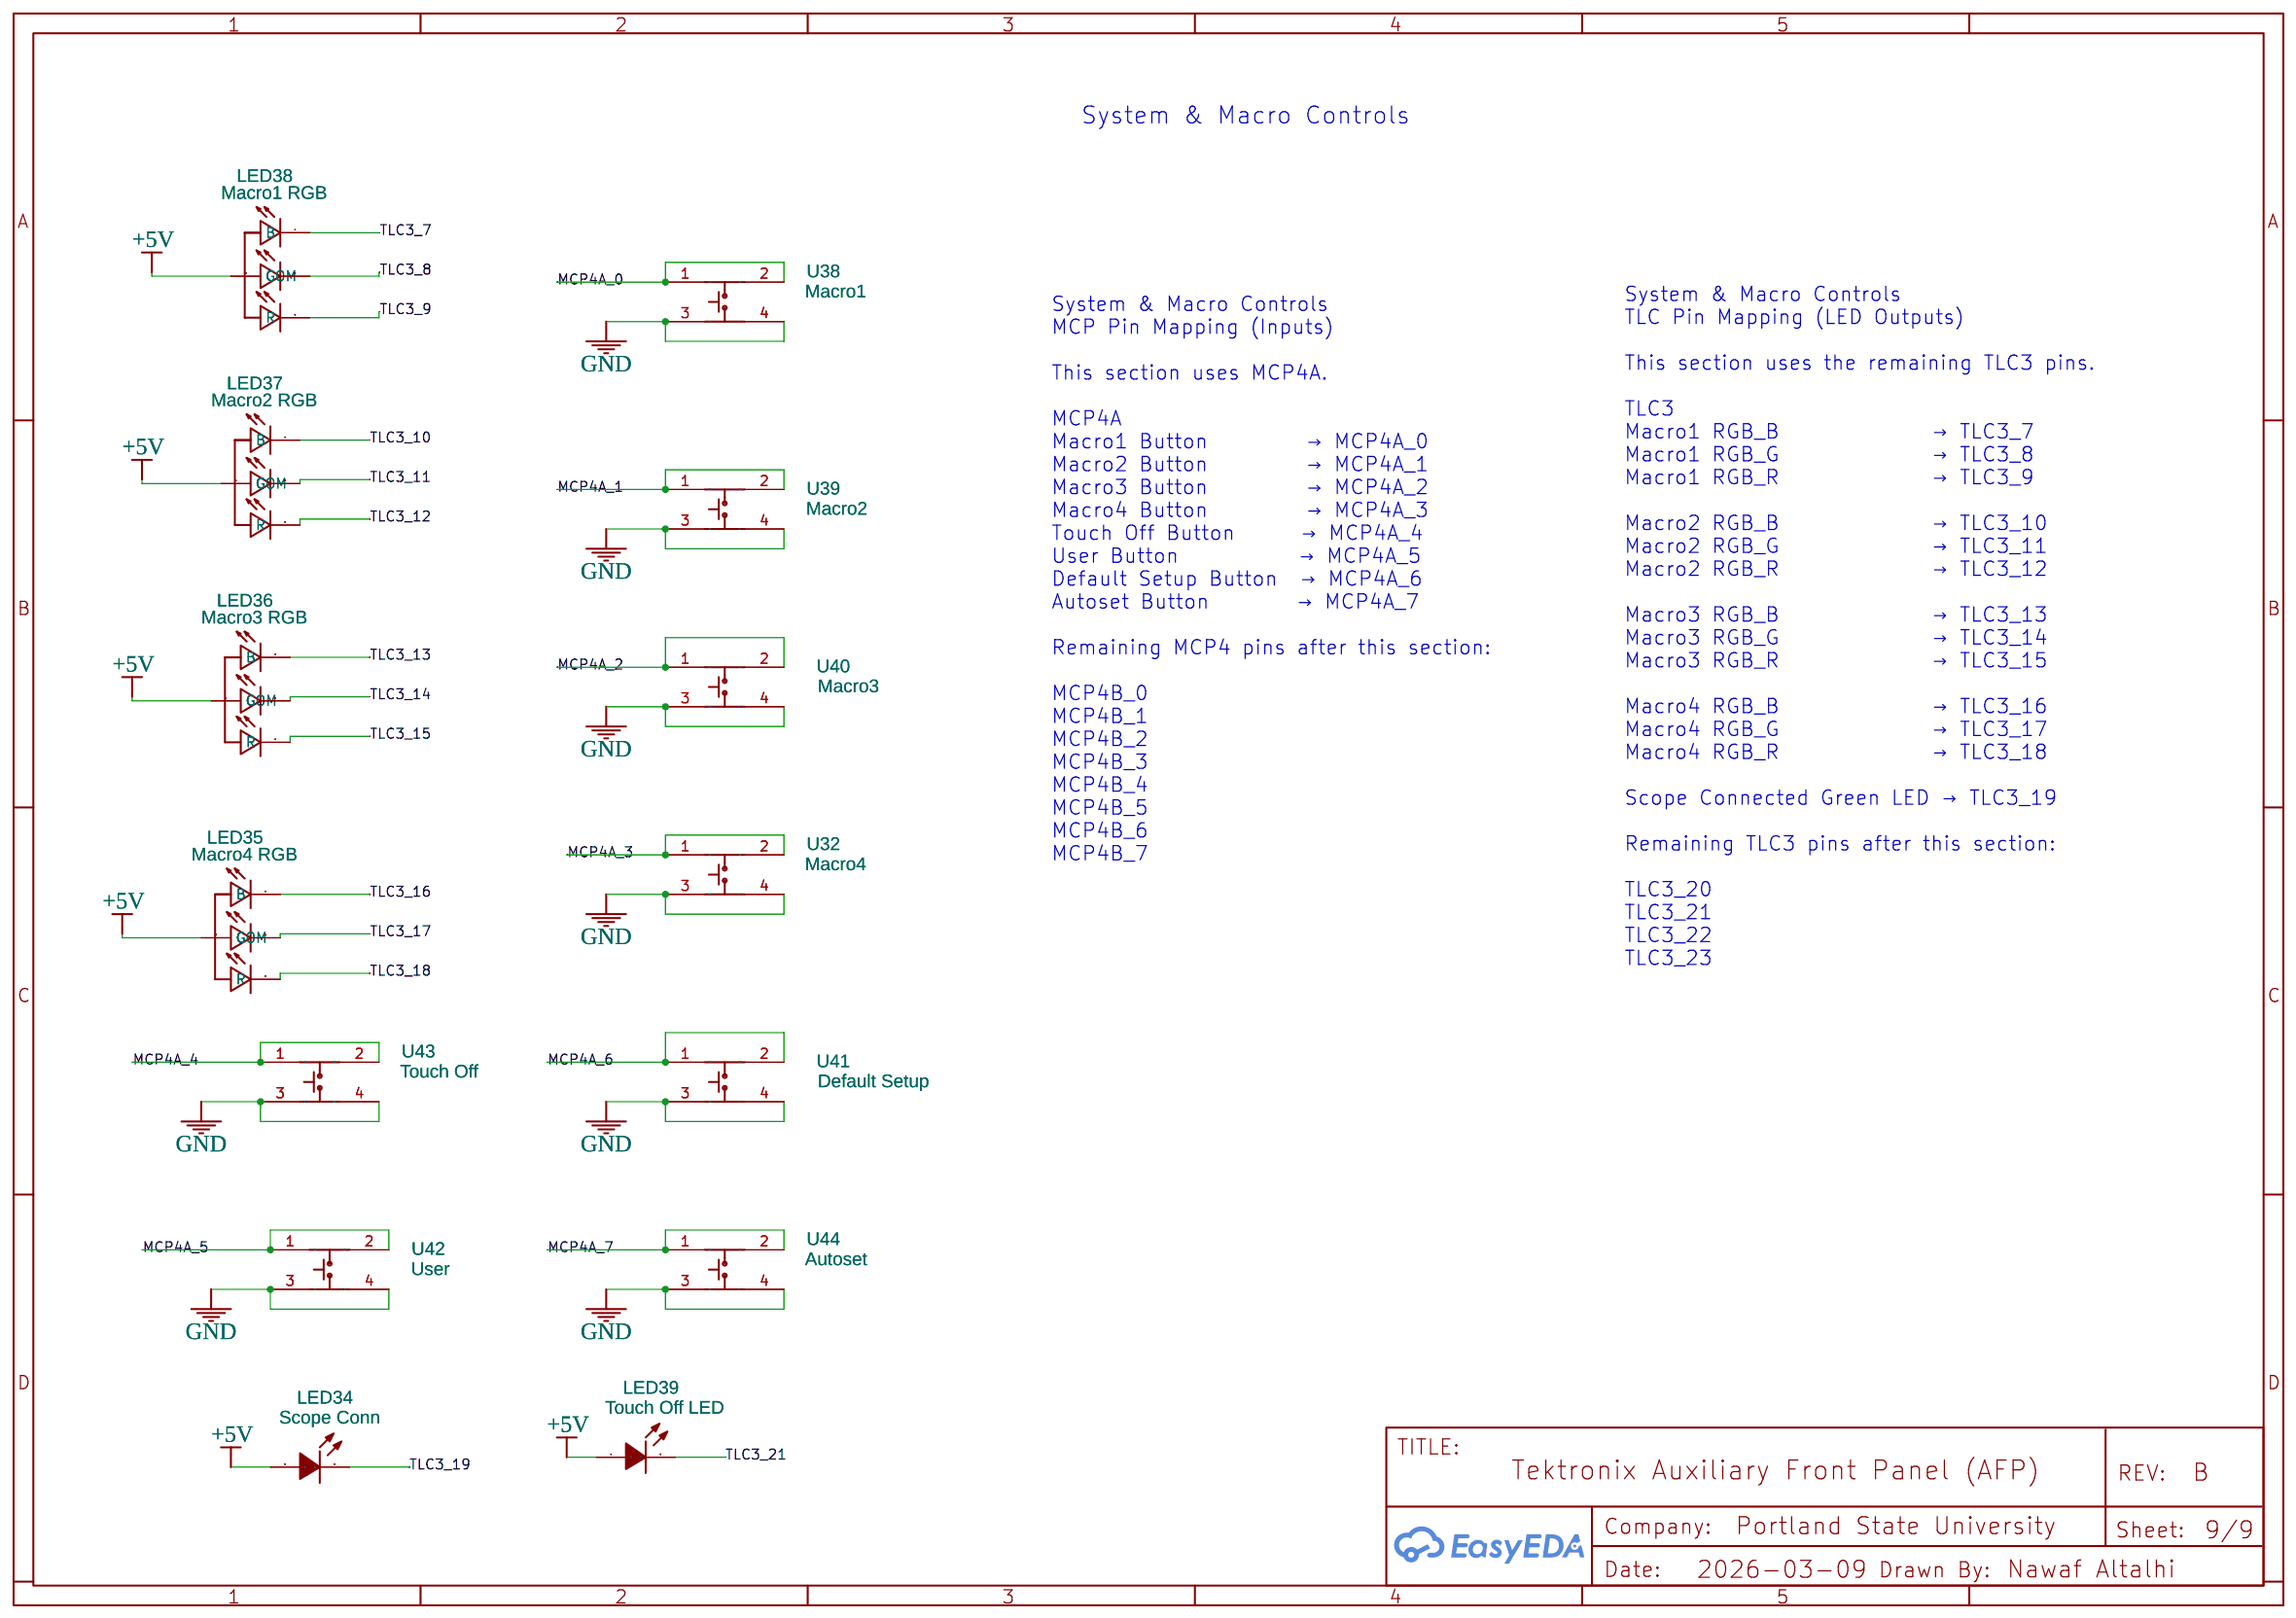
[diagram p8: Miscellaneous controls& Macro]

## Parts
sheet 5V Power Input
C11  0.1u  [C0603]
C12  DNP100u  [CAP-SMD_BD6.3-L6.6-W6.6-LS7.6-RD]
C14  DNP10u  [C0603]
J1  PJ-037AH  [PJ-037AH]
LED2  LED-0603_G  [LED0603_GREEN]
R15  1k  [R0603]
TP2  TP_5V_Source  [TESTPOINT-SMD_L1.6-W0.8]
TP3  GND  [TESTPOINT-SMD_L1.6-W0.8]
U45  SLW-1276864-4A-D  [SLW-1276864-4A-D]
sheet Acquisition & Trigger Controls
LED3  Single/Seq LED  [LED0603_GREEN]
LED4  Run/Stop RGB  [FP-AAA3528LSEEZGKQBKS-MFG]
LED5  High Res LED  [LED0603_GREEN]
LED6  Fast Acq LED  [LED0603_GREEN]
LED7  Cursors LED (White)  [LED0603_GREEN]
LED8  Encoder A LED (White)  [LED0603_GREEN]
LED9  Encoder A “Fine” LED (White)  [LED0603_GREEN]
LED10  Encoder B LED (White)  [LED0603_GREEN]
LED11  Encoder B “Fine” LED (White)  [LED0603_GREEN]
LED12  Force Ready LED (White)  [LED0603_GREEN]
LED13  Trig'd LED  [LED0603_GREEN]
LED14  Trigger Level RGB ring  [FP-AAA3528LSEEZGKQBKS-MFG]
LED15  Slope Up LED  [LED0603_GREEN]
LED16  Slope Down LED  [LED0603_GREEN]
LED17  Mode Auto LED  [LED0603_GREEN]
LED18  Mode Norm LED  [LED0603_GREEN]
U4  Single/Seq Button  [SW-SMD_4P-L4.5-W4.5-P3.00-LS7.5-BL]
U7  Run/Stop Button  [SW-SMD_4P-L4.5-W4.5-P3.00-LS7.5-BL]
U12  Clear Button  [SW-SMD_4P-L4.5-W4.5-P3.00-LS7.5-BL]
U14  Cursor B  [360_DEGREE_ROTARY_ENCODER]
U15  Cursor A  [360_DEGREE_ROTARY_ENCODER]
U16  Level  [360_DEGREE_ROTARY_ENCODER]
U17  High Res Button  [SW-SMD_4P-L4.5-W4.5-P3.00-LS7.5-BL]
U18  Cursor Button  [SW-SMD_4P-L4.5-W4.5-P3.00-LS7.5-BL]
U19  Fast Acq Button  [SW-SMD_4P-L4.5-W4.5-P3.00-LS7.5-BL]
U20  Mode  [SW-SMD_4P-L4.5-W4.5-P3.00-LS7.5-BL]
U21  Slope  [SW-SMD_4P-L4.5-W4.5-P3.00-LS7.5-BL]
U22  Force Button  [SW-SMD_4P-L4.5-W4.5-P3.00-LS7.5-BL]
sheet HORIZONTAL
LED1  Scale encoder fine  [LED0603_GREEN]
LED33  Zoom Indicator White LED  [LED0603_GREEN]
U8  Zoom encoder  [360_DEGREE_ROTARY_ENCODER]
U9  Pan encoder  [360_DEGREE_ROTARY_ENCODER]
U10  Scale encoder  [360_DEGREE_ROTARY_ENCODER]
U13  Position encoder  [360_DEGREE_ROTARY_ENCODER]
U35  Navigate Left button  [SW-SMD_4P-L4.5-W4.5-P3.00-LS7.5-BL]
U36  Navigate Right button  [SW-SMD_4P-L4.5-W4.5-P3.00-LS7.5-BL]
U37  Zoom button  [SW-SMD_4P-L4.5-W4.5-P3.00-LS7.5-BL]
sheet MCP23017
C5  0.1u  [C0603]
C6  0.1u  [C0603]
C7  0.1u  [C0603]
C8  0.1u  [C0603]
MCP1  MCP23017T-E/SO  [SOIC-28_L17.9-W7.5-P1.27-LS10.3-BL]
MCP2  MCP23017T-E/SO  [SOIC-28_L17.9-W7.5-P1.27-LS10.3-BL]
MCP3  MCP23017T-E/SO  [SOIC-28_L17.9-W7.5-P1.27-LS10.3-BL]
MCP4  MCP23017T-E/SO  [SOIC-28_L17.9-W7.5-P1.27-LS10.3-BL]
R9  10k  [R0603]
R10  10k  [R0603]
R11  10k  [R0603]
R12  10k  [R0603]
R14  220  [R0603]
R17  220  [R0603]
R18  4.7k  [R0603]
R19  4.7k  [R0603]
R20  220  [R0603]
R21  4.7k  [R0603]
R22  4.7k  [R0603]
R23  220  [R0603]
R24  220  [R0603]
R25  220  [R0603]
R26  4.7k  [R0603]
R27  4.7k  [R0603]
R28  220  [R0603]
R29  220  [R0603]
R30  4.7k  [R0603]
R31  4.7k  [R0603]
sheet Miscellaneous controls& Macro
LED34  Scope Conn  [LED0603_GREEN]
LED35  Macro4 RGB  [FP-AAA3528LSEEZGKQBKS-MFG]
LED36  Macro3 RGB  [FP-AAA3528LSEEZGKQBKS-MFG]
LED37  Macro2 RGB  [FP-AAA3528LSEEZGKQBKS-MFG]
LED38  Macro1 RGB  [FP-AAA3528LSEEZGKQBKS-MFG]
LED39  Touch Off LED  [LED0603_GREEN]
U32  Macro4  [SW-SMD_4P-L4.5-W4.5-P3.00-LS7.5-BL]
U38  Macro1  [SW-SMD_4P-L4.5-W4.5-P3.00-LS7.5-BL]
U39  Macro2  [SW-SMD_4P-L4.5-W4.5-P3.00-LS7.5-BL]
U40  Macro3  [SW-SMD_4P-L4.5-W4.5-P3.00-LS7.5-BL]
U41  Default Setup  [SW-SMD_4P-L4.5-W4.5-P3.00-LS7.5-BL]
U42  User  [SW-SMD_4P-L4.5-W4.5-P3.00-LS7.5-BL]
U43  Touch Off  [SW-SMD_4P-L4.5-W4.5-P3.00-LS7.5-BL]
U44  Autoset  [SW-SMD_4P-L4.5-W4.5-P3.00-LS7.5-BL]
sheet Raspberry Pi Controller
C10  100u  [CAP-SMD_BD6.3-L6.6-W6.6-LS7.6-RD]
C13  0.1u  [C0603]
GPIO1  2.54-2*20  [RASPI_BOTTOM_UP_GPIO]
R13  0 Ω  [R0603]
TP1  TP_5V_PI  [TESTPOINT-SMD_L1.6-W0.8]
sheet Raspberry Pi Pico Interface
C2  100u  [CAP-SMD_BD6.3-L6.6-W6.6-LS7.6-RD]
C9  0.1u  [C0603]
R3  4.7k  [R0603]
R4  4.7k  [R0603]
R16  Zero Ohm  [R0603]
TP4  I2CSCLTP  [TESTPOINT-SMD_L1.6-W0.8]
TP5  I2CSDATP  [TESTPOINT-SMD_L1.6-W0.8]
TP6  SINTP  [TESTPOINT-SMD_L1.6-W0.8]
TP7  BLANKTP  [TESTPOINT-SMD_L1.6-W0.8]
TP8  XLATTP  [TESTPOINT-SMD_L1.6-W0.8]
TP9  TXTP  [TESTPOINT-SMD_L1.6-W0.8]
TP10  RXTP  [TESTPOINT-SMD_L1.6-W0.8]
TP11  SCLKTP  [TESTPOINT-SMD_L1.6-W0.8]
U5  SC0915  [SC0915_RPI]
sheet TLC5947
C1  0.1u  [C0603]
C3  0.1u  [C0603]
C4  0.1u  [C0603]
R1  3.3k  [R0603]
R2  10k  [R0603]
R5  10k  [R0603]
R6  3.3k  [R0603]
R7  10k  [R0603]
R8  3.3k  [R0603]
U1  TLC5947DAPR, LED DRIVER  [TLC5947_TSSOP]
U2  TLC5947DAPR, LED DRIVER  [TLC5947_TSSOP]
U3  TLC5947DAPR, LED DRIVER  [TLC5947_TSSOP]
sheet VERTICAL
LED19  Vertical Position RGB  [FP-AAA3528LSEEZGKQBKS-MFG]
LED20  Vertical Scale RGB  [FP-AAA3528LSEEZGKQBKS-MFG]
LED21  Vertical Scale Fine indicator White LED  [LED0603_GREEN]
LED22  Ch1 RGB  [FP-AAA3528LSEEZGKQBKS-MFG]
LED23  Ch2 RGB  [FP-AAA3528LSEEZGKQBKS-MFG]
LED24  Ch3 RGB  [FP-AAA3528LSEEZGKQBKS-MFG]
LED25  Ch4 RGB  [FP-AAA3528LSEEZGKQBKS-MFG]
LED26  Ch5 RGB  [FP-AAA3528LSEEZGKQBKS-MFG]
LED27  Ch6 RGB  [FP-AAA3528LSEEZGKQBKS-MFG]
LED28  Ch7 RGB  [FP-AAA3528LSEEZGKQBKS-MFG]
LED29  Ch8 RGB  [FP-AAA3528LSEEZGKQBKS-MFG]
LED30  Math Orange LED  [LED0603_GREEN]
LED31  Ref White LED  [LED0603_GREEN]
LED32  Bus Purple LED  [LED0603_GREEN]
U6  Vertical Scale  [360_DEGREE_ROTARY_ENCODER]
U11  Vertical Position  [360_DEGREE_ROTARY_ENCODER]
U23  Ch3  [SW-SMD_4P-L4.5-W4.5-P3.00-LS7.5-BL]
U24  Ch2  [SW-SMD_4P-L4.5-W4.5-P3.00-LS7.5-BL]
U25  Ch1  [SW-SMD_4P-L4.5-W4.5-P3.00-LS7.5-BL]
U26  Ch8  [SW-SMD_4P-L4.5-W4.5-P3.00-LS7.5-BL]
U27  Math  [SW-SMD_4P-L4.5-W4.5-P3.00-LS7.5-BL]
U28  Ch4  [SW-SMD_4P-L4.5-W4.5-P3.00-LS7.5-BL]
U29  Ch5  [SW-SMD_4P-L4.5-W4.5-P3.00-LS7.5-BL]
U30  Ch6  [SW-SMD_4P-L4.5-W4.5-P3.00-LS7.5-BL]
U31  Ch7  [SW-SMD_4P-L4.5-W4.5-P3.00-LS7.5-BL]
U33  Ref  [SW-SMD_4P-L4.5-W4.5-P3.00-LS7.5-BL]
U34  Bus  [SW-SMD_4P-L4.5-W4.5-P3.00-LS7.5-BL]

## Library data of the parts
C1 C3-C9 C11 C13 C14 = C_0603_US: Contributor: LCEDA_Lib
C2 C10 C12 = C_Tan_SMD_A_US: Supplier Part: 80-EDT107M016A9HAA; Supplier: Mouser; Contributor: LCEDA_Lib; Manufacturer Part: EDT107M016A9HAA; Manufacturer: KEMET
J1 = PJ-037AH: Manufacturer: Same Sky (Formerly CUI Devices); Supplier Part: CP-037AH-ND; Supplier: Digi-Key; Contributor: hoff
LED1-LED3 LED5-LED13 LED15-LED18 LED21 LED30-LED33 = LED-0603_G: Manufacturer: EVERLIGHT(台湾亿光); Manufacturer Part: 19-217/GHC-YR1S2/3T; Supplier Part: C72043; Supplier: LCSC; Contributor: LCEDA_Lib
R1-R31 = R_0603_US: Contributor: LCEDA_Lib
TP2 = Connector_TestPoint: Add into BOM: yes; Convert to PCB: yes; Origin Footprint: TestPoint:TestPoint_Pad_1.0x1.0mm; Contributor: easycraig
TP1 TP3-TP11 = Connector_TestPoint: Attribute1: TP2; Add into BOM: yes; Convert to PCB: yes; Origin Footprint: TestPoint:TestPoint_Pad_1.0x1.0mm; Contributor: easycraig
U45 = SLW-1276864-4A-D: Manufacturer: Same Sky (Formerly CUI Devices); Supplier: Digi-Key; Supplier Part: 2223-SLW-1276864-4A-D-ND; Contributor: morlocks
LED4 LED14 = AAA3528LSEEZGKQBKS: Supplier: Digi-Key; Supplier Part: 754-1967-1-ND; Manufacturer: Kingbright; Contributor: LCSC
U4 U7 U12 U17-U44 = TL3305AF260QG: Supplier: Digi-Key; Supplier Part: EG5353CT-ND; Manufacturer: E-Switch; Manufacturer Part: SWITCH TACTILE SPST-NO 0.05A 12V; Contributor: lcsc
U6 U8-U11 U13-U16 = 360 Degree Rotary Encoder: Contributor: Geafer
MCP1-MCP4 = MCP23017T-E/SO: Contributor: Aidil Faiz; Supplier: Digi-Key; Supplier Part: MCP23017T-E/SOCT-ND; Manufacturer: Microchip Technology
LED34 LED39 = LED-TH-5mm_G: Manufacturer: EVERLIGHT(台湾亿光); Manufacturer Part: 333-2SYGD/S530-E2; Supplier Part: C88163; Supplier: LCSC; Contributor: LCEDA_Lib
LED19 LED20 LED22-LED29 LED35-LED38 = AAA3528LSEEZGKQBKS: Supplier: Digi-Key; Supplier Part: 754-1967-1-ND; Manufacturer Part: HQ67-23A2ARGBC; Contributor: LCSC
GPIO1 = 2.54-2*20: Contributor: tobias.staubert; Supplier: LCSC; Supplier Part: C2977589; Manufacturer: ZHOURI(洲日); JLCPCB Part Class: Extended Part
U5 = SC0915: Contributor: hiteshmandaliya12345; Supplier: Digi-Key; Supplier Part: 2648-SC0915CT-ND; Manufacturer: Raspberry Pi
U1-U3 = TLC5947DAPR, LED DRIVER: Manufacturer: Texas Instruments; Manufacturer Part: TLC5947DAPR; Supplier Part: 296-41686-1-ND; Supplier: Digi-Key; Contributor: HenryTR

## Nets
+3.3V: C1.2 C3.2 C4.2 C5.2 C6.2 C7.2 C8.2 MCP1.9(VDD) MCP1.15(A0) MCP2.9(VDD) MCP3.9(VDD) MCP3.16(A1) MCP4.9(VDD) MCP4.15(A0) MCP4.16(A1) R3.2 R4.2 R9.2 R10.2 R11.2 R12.2 R18.2 R19.2 R21.2 R22.2 R26.2 R27.2 R30.2 R31.2 U1.32(VCC) U2.32(VCC) U3.32(VCC) U5.36(3V3OUT)
+5V: C2.1 C9.2 C11.2 C12.1 C14.2 LED1.1 LED3.1 LED4.2(COM) LED5.1 LED6.1 LED7.1 LED8.1 LED9.1 LED10.1 LED11.1 LED12.1 LED13.1 LED14.2(COM) LED15.1 LED16.1 LED17.1 LED18.1 LED19.2(COM) LED20.2(COM) LED21.1 LED22.2(COM) LED23.2(COM) LED24.2(COM) LED25.2(COM) LED26.2(COM) LED27.2(COM) LED28.2(COM) LED29.2(COM) LED30.1 LED31.1 LED32.1 LED33.1 LED34.1 LED35.2(COM) LED36.2(COM) LED37.2(COM) LED38.2(COM) LED39.1 R13.2 R15.2 R16.2 TP2.1 U45.2
GND: C1.1 C2.2 C3.1 C4.1 C5.1 C6.1 C7.1 C8.1 C9.1 C10.2 C11.1 C12.2 C13.1 C14.1 GPIO1.6(GND) GPIO1.9(GND) GPIO1.14(GND) GPIO1.20(GND) GPIO1.25(GND) GPIO1.30(GND) GPIO1.34(GND) GPIO1.39(GND) J1.2 LED2.2 MCP1.10(VSS) MCP1.16(A1) MCP1.17(A2) MCP2.10(VSS) MCP2.15(A0) MCP2.16(A1) MCP2.17(A2) MCP3.10(VSS) MCP3.15(A0) MCP3.17(A2) MCP4.10(VSS) MCP4.17(A2) R1.2 R2.1 R5.1 R6.2 R7.1 R8.2 TP3.1 U1.1(GND) U1.33(PAD) U2.1(GND) U2.33(PAD) U3.1(GND) U3.33(PAD) U4.3 U4.4 U5.3(GND) U5.8(GND) U5.13(GND) U5.18(GND) U5.23(GND) U5.28(GND) U5.33(AGND/GND) U5.38(GND) U5.A(GND) U5.B(GND) U5.C(GND) U5.D(GND) U5.D2(GND) U6.2(GND) U6.4(C) U7.3 U7.4 U8.2(GND) U8.4(C) U9.2(GND) U9.4(C) U10.2(GND) U10.4(C) U11.2(GND) U11.4(C) U12.3 U12.4 U13.2(GND) U13.4(C) U14.2(GND) U14.4(C) U15.2(GND) U15.4(C) U16.2(GND) U16.4(C) U17.3 U17.4 U18.3 U18.4 U19.3 U19.4 U20.3 U20.4 U21.3 U21.4 U22.3 U22.4 U23.3 U23.4 U24.3 U24.4 U25.3 U25.4 U26.3 U26.4 U27.3 U27.4 U28.3 U28.4 U29.3 U29.4 U30.3 U30.4 U31.3 U31.4 U32.3 U32.4 U33.3 U33.4 U34.3 U34.4 U35.3 U35.4 U36.3 U36.4 U37.3 U37.4 U38.3 U38.4 U39.3 U39.4 U40.3 U40.4 U41.3 U41.4 U42.3 U42.4 U43.3 U43.4 U44.3 U44.4
I2C_SCL: MCP1.12(SCK) MCP2.12(SCK) MCP3.12(SCK) MCP4.12(SCK) R4.1 TP4.1 U5.2(UART0_RX/I2C0_SCL/GPI0_CSn/GP1)
I2C_SDA: MCP1.13(SDA) MCP2.13(SDA) MCP3.13(SDA) MCP4.13(SDA) R3.1 TP5.1 U5.1(UART0_TX/I2C0_SDA/SPI0_RX/GP0)
MCP1_INTA: R14.2 R18.1 U5.4(I2C1_SDA/SPI0_SCK/GP2)
MCP1_INTB: R17.2 R19.1 U5.5(I2C1_SCL/SPI0_TX/GP3)
MCP1A_0: MCP1.21(GPA0) U4.1 U4.2
MCP1A_1: MCP1.22(GPA1) U7.1 U7.2
MCP1A_2: MCP1.23(GPA2) U12.1 U12.2
MCP1A_3: MCP1.24(GPA3) U17.1 U17.2
MCP1A_4: MCP1.25(GPA4) U19.1 U19.2
MCP1A_5: MCP1.26(GPA5) U18.1 U18.2
MCP1A_6: MCP1.27(GPA6) U22.1 U22.2
MCP1A_7: MCP1.28(GPA7) U21.1 U21.2
MCP1B_0: MCP1.1(GPB0) U20.1 U20.2
MCP1B_1: MCP1.2(GPB1) U15.3(A)
MCP1B_2: MCP1.3(GPB2) U15.5(B)
MCP1B_3: MCP1.4(GPB3) U15.1(SW)
MCP1B_4: MCP1.5(GPB4) U14.3(A)
MCP1B_5: MCP1.6(GPB5) U14.5(B)
MCP1B_6: MCP1.7(GPB6) U14.1(SW)
MCP1B_7: MCP1.8(GPB7) U16.3(A)
MCP2_INTA: R20.2 R21.1 U5.6(UART1_TX/I2C0_SDA/SPI0_RX/GP4)
MCP2_INTB: R22.1 R23.2 U5.7(UART1_RX/I2C0_SCL/SPI0_CSn/GP5)
MCP2A_0: MCP2.21(GPA0) U16.5(B)
MCP2A_1: MCP2.22(GPA1) U16.1(SW)
MCP2A_2: MCP2.23(GPA2) U11.3(A)
MCP2A_3: MCP2.24(GPA3) U11.5(B)
MCP2A_4: MCP2.25(GPA4) U11.1(SW)
MCP2A_5: MCP2.26(GPA5) U6.3(A)
MCP2A_6: MCP2.27(GPA6) U6.5(B)
MCP2A_7: MCP2.28(GPA7) U6.1(SW)
MCP2B_0: MCP2.1(GPB0) U25.1 U25.2
MCP2B_1: MCP2.2(GPB1) U24.1 U24.2
MCP2B_2: MCP2.3(GPB2) U23.1 U23.2
MCP2B_3: MCP2.4(GPB3) U28.1 U28.2
MCP2B_4: MCP2.5(GPB4) U29.1 U29.2
MCP2B_5: MCP2.6(GPB5) U30.1 U30.2
MCP2B_6: MCP2.7(GPB6) U31.1 U31.2
MCP2B_7: MCP2.8(GPB7) U26.1 U26.2
MCP3_INTA: R29.2 R30.1 U5.9(I2C1_SDA/SPI0_SCK/GP6)
MCP3_INTB: R28.2 R31.1 U5.10(I2C1_SCL/SPI0_TX/GP7)
MCP3A_0: MCP3.21(GPA0) U27.1 U27.2
MCP3A_1: MCP3.22(GPA1) U33.1 U33.2
MCP3A_2: MCP3.23(GPA2) U34.1 U34.2
MCP3A_3: MCP3.24(GPA3) U13.3(A)
MCP3A_4: MCP3.25(GPA4) U13.5(B)
MCP3A_5: MCP3.26(GPA5) U13.1(SW)
MCP3A_6: MCP3.27(GPA6) U10.3(A)
MCP3A_7: MCP3.28(GPA7) U10.5(B)
MCP3B_0: MCP3.1(GPB0) U10.1(SW)
MCP3B_1: MCP3.2(GPB1) U8.3(A)
MCP3B_2: MCP3.3(GPB2) U8.5(B)
MCP3B_3: MCP3.4(GPB3) U9.3(A)
MCP3B_4: MCP3.5(GPB4) U9.5(B)
MCP3B_5: MCP3.6(GPB5) U35.1 U35.2
MCP3B_6: MCP3.7(GPB6) U36.1 U36.2
MCP3B_7: MCP3.8(GPB7) U37.1 U37.2
MCP4_INTA: R25.2 R26.1 U5.11(UART1_TX/I2C0_SDA/SPI1_RX/GP8)
MCP4_INTB: R24.2 R27.1 U5.12(UART1_RX/I2C0_SCL/SPI1_CSn/GP9)
MCP4A_0: MCP4.21(GPA0) U38.1 U38.2
MCP4A_1: MCP4.22(GPA1) U39.1 U39.2
MCP4A_2: MCP4.23(GPA2) U40.1 U40.2
MCP4A_3: MCP4.24(GPA3) U32.1 U32.2
MCP4A_4: MCP4.25(GPA4) U43.1 U43.2
MCP4A_5: MCP4.26(GPA5) U42.1 U42.2
MCP4A_6: MCP4.27(GPA6) U41.1 U41.2
MCP4A_7: MCP4.28(GPA7) U44.1 U44.2
PICO_TLC_BLANK: R2.2 R5.2 R7.2 TP7.1 U1.2(BLANK) U2.2(BLANK) U3.2(BLANK) U5.26(I2C0_SDA/GP20)
PICO_TLC_SCLK: TP11.1 U1.3(SCLK) U2.3(SCLK) U3.3(SCLK) U5.24(I2C1_SDA/SPI0_SCK/GP18)
PICO_TLC_SIN: TP6.1 U1.4(SIN) U5.25(I2C1_SCL/SPI0_TX/GP19)
PICO_TLC_XLAT: TP8.1 U1.30(XLAT) U2.30(XLAT) U3.30(XLAT) U5.29(GP22)
SOUT1_TLC2: U1.29(SOUT) U2.4(SIN)
SOUT2_TLC3: U2.29(SOUT) U3.4(SIN)
TLC1_0: LED14.4(B) U1.5(OUT0)
TLC1_1: LED14.3(G) U1.6(OUT1)
TLC1_2: LED14.1(R) U1.7(OUT2)
TLC1_3: LED4.4(B) U1.8(OUT3)
TLC1_4: LED4.3(G) U1.9(OUT4)
TLC1_5: LED4.1(R) U1.10(OUT5)
TLC1_6: LED3.2 U1.11(OUT6)
TLC1_7: LED5.2 U1.12(OUT7)
TLC1_8: LED6.2 U1.13(OUT8)
TLC1_9: LED7.2 U1.14(OUT9)
TLC1_10: LED8.2 U1.15(OUT10)
TLC1_11: LED9.2 U1.16(OUT11)
TLC1_12: LED10.2 U1.17(OUT12)
TLC1_13: LED11.2 U1.18(OUT13)
TLC1_14: LED12.2 U1.19(OUT14)
TLC1_15: LED13.2 U1.20(OUT15)
TLC1_16: LED15.2 U1.21(OUT16)
TLC1_17: LED16.2 U1.22(OUT17)
TLC1_18: LED17.2 U1.23(OUT18)
TLC1_19: LED18.2 U1.24(OUT19)
TLC1_20: LED21.2 U1.25(OUT20)
TLC1_21: LED30.2 U1.26(OUT21)
TLC1_22: LED31.2 U1.27(OUT22)
TLC1_23: LED32.2 U1.28(OUT23)
TLC2_0: LED19.4(B) U2.5(OUT0)
TLC2_1: LED19.3(G) U2.6(OUT1)
TLC2_2: LED19.1(R) U2.7(OUT2)
TLC2_3: LED20.4(B) U2.8(OUT3)
TLC2_4: LED20.3(G) U2.9(OUT4)
TLC2_5: LED20.1(R) U2.10(OUT5)
TLC2_6: LED22.4(B) U2.11(OUT6)
TLC2_7: LED22.3(G) U2.12(OUT7)
TLC2_8: LED22.1(R) U2.13(OUT8)
TLC2_9: LED23.4(B) U2.14(OUT9)
TLC2_10: LED23.3(G) U2.15(OUT10)
TLC2_11: LED23.1(R) U2.16(OUT11)
TLC2_12: LED24.4(B) U2.17(OUT12)
TLC2_13: LED24.3(G) U2.18(OUT13)
TLC2_14: LED24.1(R) U2.19(OUT14)
TLC2_15: LED25.4(B) U2.20(OUT15)
TLC2_16: LED25.3(G) U2.21(OUT16)
TLC2_17: LED25.1(R) U2.22(OUT17)
TLC2_18: LED26.4(B) U2.23(OUT18)
TLC2_19: LED26.3(G) U2.24(OUT19)
TLC2_20: LED26.1(R) U2.25(OUT20)
TLC2_21: LED27.4(B) U2.26(OUT21)
TLC2_22: LED27.3(G) U2.27(OUT22)
TLC2_23: LED27.1(R) U2.28(OUT23)
TLC3_0: LED28.4(B) U3.5(OUT0)
TLC3_1: LED28.3(G) U3.6(OUT1)
TLC3_2: LED28.1(R) U3.7(OUT2)
TLC3_3: LED29.4(B) U3.8(OUT3)
TLC3_4: LED29.3(G) U3.9(OUT4)
TLC3_5: LED29.1(R) U3.10(OUT5)
TLC3_6: LED33.2 U3.11(OUT6)
TLC3_7: LED38.4(B) U3.12(OUT7)
TLC3_8: LED38.3(G) U3.13(OUT8)
TLC3_9: LED38.1(R) U3.14(OUT9)
TLC3_10: LED37.4(B) U3.15(OUT10)
TLC3_11: LED37.3(G) U3.16(OUT11)
TLC3_12: LED37.1(R) U3.17(OUT12)
TLC3_13: LED36.4(B) U3.18(OUT13)
TLC3_14: LED36.3(G) U3.19(OUT14)
TLC3_15: LED36.1(R) U3.20(OUT15)
TLC3_16: LED35.4(B) U3.21(OUT16)
TLC3_17: LED35.3(G) U3.22(OUT17)
TLC3_18: LED35.1(R) U3.23(OUT18)
TLC3_19: LED34.2 U3.24(OUT19)
TLC3_20: LED1.2 U3.25(OUT20)
TLC3_21: LED39.2 U3.26(OUT21)
UART_RX_PICO: GPIO1.8(GPIO 14) TP10.1 U5.22(UART0_RX/I2C0_SCL/SPI0_CSn/GP17)
UART_TX_PICO: GPIO1.10(GPIO 15) TP9.1 U5.21(UART0_TX/I2C0_SDA/SPI0_RX/GP16)
Net-(C10-1): C10.1 C13.2 GPIO1.2(5V) GPIO1.4(5V) R13.1 TP1.1
Net-(J1-1): J1.1 U45.1
Net-(LED2-1): LED2.1 R15.1
Net-(MCP1-18): MCP1.18(RESET#) R9.1
Net-(MCP1-19): MCP1.19(INTB) R17.1
Net-(MCP1-20): MCP1.20(INTA) R14.1
Net-(MCP2-18): MCP2.18(RESET#) R10.1
Net-(MCP2-19): MCP2.19(INTB) R23.1
Net-(MCP2-20): MCP2.20(INTA) R20.1
Net-(MCP3-18): MCP3.18(RESET#) R11.1
Net-(MCP3-19): MCP3.19(INTB) R28.1
Net-(MCP3-20): MCP3.20(INTA) R29.1
Net-(MCP4-18): MCP4.18(RESET#) R12.1
Net-(MCP4-19): MCP4.19(INTB) R24.1
Net-(MCP4-20): MCP4.20(INTA) R25.1
Net-(R1-1): R1.1 U1.31(IREF)
Net-(R6-1): R6.1 U2.31(IREF)
Net-(R8-1): R8.1 U3.31(IREF)
Net-(R16-1): R16.1 U5.39(VSYS)

Not connected (* = marked no-connect by the designer): GPIO1 1(3.3V)* 3(GPIO 2)* 5(GPIO 3)* 7(GPIO 4)* 11(GPIO 17)* 12(GPIO 18)* 13(GPIO 27)* 15(GPIO 22)* 16(GPIO 23)* 17(3.3V)* 18(GPIO 24)* 19(GPIO 10)* 21(GPIO 9)* 22(GPIO 25)* 23(GPIO 11)* 24(GPIO 8)* 26(GPIO 7)* 27(GPIO 0)* 28(GPIO 1)* 29(GPIO 5)* 31(GPIO 6)* 32(GPIO 12)* 33(GPIO 13)* 35(GPIO 19)* 36(GPIO 16)* 37(GPIO 26)* 38(GPIO 20)* 40(GPIO 21)*; MCP1 11(NC)* 14(NC)*; MCP2 11(NC)* 14(NC)*; MCP3 11(NC)* 14(NC)*; MCP4 1(GPB0)* 2(GPB1)* 3(GPB2)* 4(GPB3)* 5(GPB4)* 6(GPB5)* 7(GPB6)* 8(GPB7)* 11(NC)* 14(NC)*; U3 27(OUT22)* 28(OUT23)* 29(SOUT)*; U5 14(I2C1_SDA/SPI1_SCK/GP10)* 15(I2C1_SCL/SPI1_TX/GP11)* 16(UART0_TX/I2C0_SDA/GPI1_RX/GP12)* 17(UART0_RX/I2C0_SCL/SPI1_CSn/GP13)* 19(I2C1_SDA/SPI1_SCK/GP14)* 20(I2C1_SCL/SPI1_TX/GP15)* 27(I2C0_SCL/GP21)* 30(RUN)* 31(I2C1_SDA/ADC0/GP26)* 32(I2C1_SCL/ADC1/GP27)* 34(ADC2/GP28)* 35(ADC_VREF)* 37(3V3_EN)* 40(VBUS)* D1(SWCLK)* D3(SWDIO)* TP1(GND)* TP2(USB_DM)* TP3(USB_DP)* TP4(GPIO/SMPS)* TP5(GPIO25/LED)* TP6(BOOTSEL)*; U8 1(SW)*; U9 1(SW)*; U45 3*

## Notes on the sheets
sheet 1
- POWER INPUT CIRCUIT
- S2 is the main power switch for the PCB.
  When S2 is switched ON, the +5V rail is applied to the
  system and powers the Raspberry Pi, Raspberry Pi Pico,
  and the PCB 5V loads.
- +5V OUT
- TP2 provides a test point for the incoming +5V supply.
  TP3 provides a test point for power ground.
- External power is provided by a 5V / 5A wall adapter
  (Qualtek QAWA-30-5) through the PJ-037AH DC barrel jack.
  J1 Pin 1 is the center pin and is connected to +5V.
  J1 Pin 2 is the outer sleeve and is connected to GND.
- C12 (100 µF) provides bulk filtering and helps stabilize
  the 5V input rail during load transients.
  C11 (100 nF) provides high-frequency decoupling for the
  input supply and reduces switching and line noise.
- electrolytic
- The green LED indicates that system power is ON.
sheet 2
- Front Panel Interface Controller (Raspberry Pi Pico)
- +5VIN
- +3V3OUT
- PICO INTERFACE CONTROLLER
  • Pico receives push-button states from MCP I/O expander via I2C (SDA, SCL).
  • Button events are transmitted to the main Raspberry Pi using UART
    communication (GPIO21 RX, GPIO22 TX).
  • Pico controls LED driver devices through serial control interface
    (SIN, SCLK, XLAT, BLANK).
  • Pico is powered from the system 5V rail applied to VSYS (Pin 39)
    from the PCB power input.
  • Pico onboard regulator generates 3.3V which powers the MCP device,
    TLC logic supply, and I2C pull-up resistors.
  • Pico acts only as a communication and control interface between
    the front panel hardware and the main Raspberry Pi system.
- DNP
- DNP
- 0 Ω resistors are placed in series with the 5V supply to Raspberry Pi Pico.
  When these resistors are installed, the Raspberry Pi Pico is powered
  from the PCB 5V power rail.
  If the resistors are removed, the Raspberry Pi Pico can instead be
  powered through its USB power connector.
- Power supply filtering:
  0.1 µF capacitor for high-frequency decoupling.
  100 µF bulk capacitor for 5V rail stabilization.
- Tektronix Auxiliary Front Panel (AFP)
sheet 3
- Raspberry Pi Controller & Display
- RASPBERRY PI – PICO COMMUNICATION NOTE
  • Raspberry Pi is powered from the PCB 5V supply through
    GPIO pins 2 and 4.
  • UART communication between Raspberry Pi and Pico uses
    GPIO14 (TXD, Pin 8) and GPIO15 (RXD, Pin 10).
  • Pico UART pins are:
    Pin 21 → TX
    Pin 22 → RX
  • UART signals must be crossed:
    Pi TX (GPIO14) → Pico RX (Pin 22)
    Pi RX (GPIO15) → Pico TX (Pin 21)
  • Raspberry Pi communicates with the Tektronix oscilloscope
    through the USB interface.
  • When programming through the USB-C port, external PCB
    power should be turned OFF to avoid powering the Raspberry
    Pi from two sources simultaneously.
  • PCB power can be disabled using the system power switch
    or by removing the GPIO header jumper connection.
- 0 Ω resistors are placed in series with the 5V supply to Raspberry Pi
  GPIO pins 2 and 4.
  When these resistors are installed, the Raspberry Pi is powered
  from the PCB 5V power rail.
  If the resistors are removed, the Raspberry Pi can instead be
  powered through its USB-C power connector.
  These resistors provide a simple way to select the Raspberry Pi
  power source during testing or future system changes.
- Display used in the system:
  4D Systems 4DHDMI-70-800-480-CT-EAR-500
  7.0" HDMI TFT LCD display
  Resolution: 800 x 480
  Capacitive touch panel
  Brightness: 500 cd/m²
  Operating voltage: 4.8V – 5.2V
  The display is connected externally to the Raspberry Pi
  using standard HDMI and USB connections.
  Video signal is provided through the Raspberry Pi HDMI port.
  Touch interface is provided through the Raspberry Pi USB port.
  The display is powered from the Raspberry Pi USB port
  and therefore no dedicated display power circuitry is
  implemented on this PCB.
  Because the display is externally powered and connected
  through standard cables, a separate schematic sheet for
  the display interface is not required.
  All display connections are handled directly by the
  Raspberry Pi hardware interface.
- +5VIN
- TP1 provides a measurement point for the 5V supply rail that
  powers the Raspberry Pi. This test point can be used to verify
  the presence and stability of the 5V input during debugging
  and system validation.
- DNP
- DNP
- Power supply filtering:
  0.1 µF capacitor for high-frequency decoupling.
  100 µF bulk capacitor for 5V rail stabilization.
sheet 4
- I2C GPIO Expanders (MCP23017)
- MCP23017 I/O expanders are powered from the Pico 3.3V rail and connected
  to the shared I2C bus (SCL, SDA).
  Each device provides 16 programmable GPIO pins arranged as
  two 8-bit ports (GPIOA and GPIOB) used for reading push buttons
  and rotary encoders on the front panel.
  Operating voltage range: 1.8V – 5.5V
  Typical supply current: ~1 mA per device
  Maximum I2C clock frequency: up to 1.7 MHz.
  Each device uses a unique hardware address through pins
  A0, A1, and A2.
  Address configuration used in this design:
  MCP1 → A2=0 A1=0 A0=1 → I2C address 0x20
  MCP2 → A2=0 A1=0 A0=0 → I2C address 0x21
  MCP3 → A2=0 A1=1 A0=0 → I2C address 0x22
  MCP4 → A2=0 A1=1 A0=1 → I2C address 0x23
  RESET is pulled up to 3.3V through a 10 kΩ resistor.
  INTA and INTB are not used in this design and are left
  unconnected.
  A 0.1 µF decoupling capacitor is placed across VDD and VSS
  for each MCP23017 device.
  Estimated total current consumption for four devices
  is approximately 4 mA from the Pico 3.3V regulator.
- +3.3V_IN
- +3.3V_IN
- +3.3V_IN
- +3.3V_IN
sheet 5
- TLC5947 LED DRIVER
- BLANK is controlled by the Raspberry Pi Pico and is used
  to disable LED outputs during PWM refresh cycles.
  A 10 kΩ pull-down resistor ensures the BLANK signal
  remains LOW during startup to prevent floating inputs.
- Three TLC5947 24-channel constant-current LED drivers are used
  to control the front-panel LEDs.
  The devices are daisy-chained through the serial data interface:
  Pico SIN → TLC1 SIN
  TLC1 SOUT → TLC2 SIN
  TLC2 SOUT → TLC3 SIN
  TLC3 SOUT is unused.
  SCLK, XLAT, and BLANK are shared by all three devices and are
  driven by the Raspberry Pi Pico.
  Each TLC5947 is powered from the 3.3V logic rail.
  The exposed thermal pad is connected to GND.
  Each device includes a 0.1 µF decoupling capacitor between
  VCC and GND.
  BLANK is connected to the Pico and also pulled low through a
  10 kΩ resistor to define a known startup state.
  LED anodes are powered directly from the main +5V PCB supply.
  The TLC5947 does not source LED power; each OUTx pin acts as a
  constant-current sink output.
  The output current of each channel is set by the RIREF resistor.
  For RIREF = 3.3 kΩ:
  IOUT ≈ 11.8 mA per channel
  Maximum sink current per TLC5947 with all 24 channels on:
  ≈ 283 mA
  Maximum sink current for three TLC5947 devices:
  ≈ 850 mA
  Each TLC5947 provides 24 PWM-controlled output channels with
  12-bit grayscale control (4096 levels).
- BLANK = HIGH  → LEDs OFF
  BLANK = LOW   → LEDs operate normally
- Default state = LOW
sheet 6
- Acquisition & Trigger Controls
- NOTE: NAV buttons are wired active-LOW (switch to GND).
  Enable MCP23017 internal pull-ups on these inputs in firmware to prevent floating inputs.
- MCP Pin Mapping (Inputs)
  MCP1A
  Encoder Cursor A_A     → MCP1A_0
  Encoder Cursor A_B     → MCP1A_1
  Encoder Cursor A_SW    → MCP1A_2
  Encoder Cursor B_A     → MCP1A_3
  Encoder Cursor B_B     → MCP1A_4
  Encoder Cursor B_SW    → MCP1A_5
  Encoder Level_A        → MCP1A_6
  Encoder Level_B        → MCP1A_7
- MCP1B
  Encoder Level_SW       → MCP1B_0
  Single/Seq Button      → MCP1B_1
  Run/Stop Button        → MCP1B_2
  Clear Button           → MCP1B_3
  High Res Button        → MCP1B_4
  Fast Acq Button        → MCP1B_5
  Cursors Button         → MCP1B_6
  Force Button           → MCP1B_7
- MCP2A
  Slope Button           → MCP2A_0
  Mode Button            → MCP2A_1
- Trigger Section
- TLC Pin Mapping (LED Outputs)
  TLC1
  Single/Seq LED         → TLC1_0
  Run/Stop RGB_B         → TLC1_1
  Run/Stop RGB_G         → TLC1_2
  Run/Stop RGB_R         → TLC1_3
  High Res LED           → TLC1_4
  Fast Acq LED           → TLC1_5
  Cursors LED            → TLC1_6
- TLC1 Continued
  Force Ready LED        → TLC1_14
  Trig'd LED             → TLC1_15
  Slope Up LED           → TLC1_16
  Slope Down LED         → TLC1_17
  Mode Auto LED          → TLC1_18
  Mode Norm LED          → TLC1_19
- Encoder A Fine LED     → TLC1_7
  Encoder A Coarse LED   → TLC1_8
  Encoder B Fine LED     → TLC1_9
  Encoder B Coarse LED   → TLC1_10
  Trigger Level RGB_B    → TLC1_11
  Trigger Level RGB_G    → TLC1_12
  Trigger Level RGB_R    → TLC1_13
sheet 7
- Vertical Controls
- TLC2
  Vertical Position RGB_B    → TLC2_0
  Vertical Position RGB_G    → TLC2_1
  Vertical Position RGB_R    → TLC2_2
  Vertical Scale RGB_B       → TLC2_3
  Vertical Scale RGB_G       → TLC2_4
  Vertical Scale RGB_R       → TLC2_5
  Ch1 RGB_B                  → TLC2_6
  Ch1 RGB_G                  → TLC2_7
  Ch1 RGB_R                  → TLC2_8
  Ch2 RGB_B                  → TLC2_9
  Ch2 RGB_G                  → TLC2_10
  Ch2 RGB_R                  → TLC2_11
  Ch3 RGB_B                  → TLC2_12
  Ch3 RGB_G                  → TLC2_13
  Ch3 RGB_R                  → TLC2_14
  Ch4 RGB_B                  → TLC2_15
  Ch4 RGB_G                  → TLC2_16
  Ch4 RGB_R                  → TLC2_17
  Ch5 RGB_B                  → TLC2_18
  Ch5 RGB_G                  → TLC2_19
  Ch5 RGB_R                  → TLC2_20
  Ch6 RGB_B                  → TLC2_21
  Ch6 RGB_G                  → TLC2_22
  Ch6 RGB_R                  → TLC2_23
  TLC3
  Ch7 RGB_B                  → TLC3_0
  Ch7 RGB_G                  → TLC3_1
  Ch7 RGB_R                  → TLC3_2
  Ch8 RGB_B                  → TLC3_3
  Ch8 RGB_G                  → TLC3_4
  Ch8 RGB_R                  → TLC3_5
- MCP Pin Mapping (Inputs)
  MCP2A
  Vertical Position_A    → MCP2A_2
  Vertical Position_B    → MCP2A_3
  Vertical Position_SW   → MCP2A_4
  Vertical Scale_A       → MCP2A_5
  Vertical Scale_B       → MCP2A_6
  Vertical Scale_SW      → MCP2A_7
- MCP2B
  Ch1 Button             → MCP2B_0
  Ch2 Button             → MCP2B_1
  Ch3 Button             → MCP2B_2
  Ch4 Button             → MCP2B_3
  Ch5 Button             → MCP2B_4
  Ch6 Button             → MCP2B_5
  Ch7 Button             → MCP2B_6
  Ch8 Button             → MCP2B_7
- MCP3A
  Math Button            → MCP3A_0
  Ref Button             → MCP3A_1
  Bus Button             → MCP3A_2
- Remaining TLC1 pins
  Vertical Scale Fine LED    → TLC1_20
  Math Orange LED            → TLC1_21
  Ref White LED              → TLC1_22
  Bus Purple LED             → TLC1_23
sheet 8
- Horizontal Controls
- Horizontal Controls
  MCP Pin Mapping (Inputs)
  This section uses the remaining pins of MCP3.
  MCP3A
  Position Encoder_A     → MCP3A_3
  Position Encoder_B     → MCP3A_4
  Position Encoder_SW    → MCP3A_5
  Scale Encoder_A        → MCP3A_6
  Scale Encoder_B        → MCP3A_7
  MCP3B
  Scale Encoder_SW       → MCP3B_0
  Zoom Encoder_A         → MCP3B_1
  Zoom Encoder_B         → MCP3B_2
  Pan Encoder_A          → MCP3B_3
  Pan Encoder_B          → MCP3B_4
  Navigate Left Button   → MCP3B_5
  Navigate Right Button  → MCP3B_6
  Zoom Button            → MCP3B_7
  TLC Pin Mapping (LED Outputs)
  This section only has one LED indicator.
  TLC3
  Zoom White LED         → TLC3_6
sheet 9
- System & Macro Controls
- System & Macro Controls
  MCP Pin Mapping (Inputs)
  This section uses MCP4A.
  MCP4A
  Macro1 Button         → MCP4A_0
  Macro2 Button         → MCP4A_1
  Macro3 Button         → MCP4A_2
  Macro4 Button         → MCP4A_3
  Touch Off Button      → MCP4A_4
  User Button           → MCP4A_5
  Default Setup Button  → MCP4A_6
  Autoset Button        → MCP4A_7
  Remaining MCP4 pins after this section:
  MCP4B_0
  MCP4B_1
  MCP4B_2
  MCP4B_3
  MCP4B_4
  MCP4B_5
  MCP4B_6
  MCP4B_7
- System & Macro Controls
  TLC Pin Mapping (LED Outputs)
  This section uses the remaining TLC3 pins.
  TLC3
  Macro1 RGB_B              → TLC3_7
  Macro1 RGB_G              → TLC3_8
  Macro1 RGB_R              → TLC3_9
  Macro2 RGB_B              → TLC3_10
  Macro2 RGB_G              → TLC3_11
  Macro2 RGB_R              → TLC3_12
  Macro3 RGB_B              → TLC3_13
  Macro3 RGB_G              → TLC3_14
  Macro3 RGB_R              → TLC3_15
  Macro4 RGB_B              → TLC3_16
  Macro4 RGB_G              → TLC3_17
  Macro4 RGB_R              → TLC3_18
  Scope Connected Green LED → TLC3_19
  Remaining TLC3 pins after this section:
  TLC3_20
  TLC3_21
  TLC3_22
  TLC3_23
